# Altium project climCtrl_V1.PrjPcb
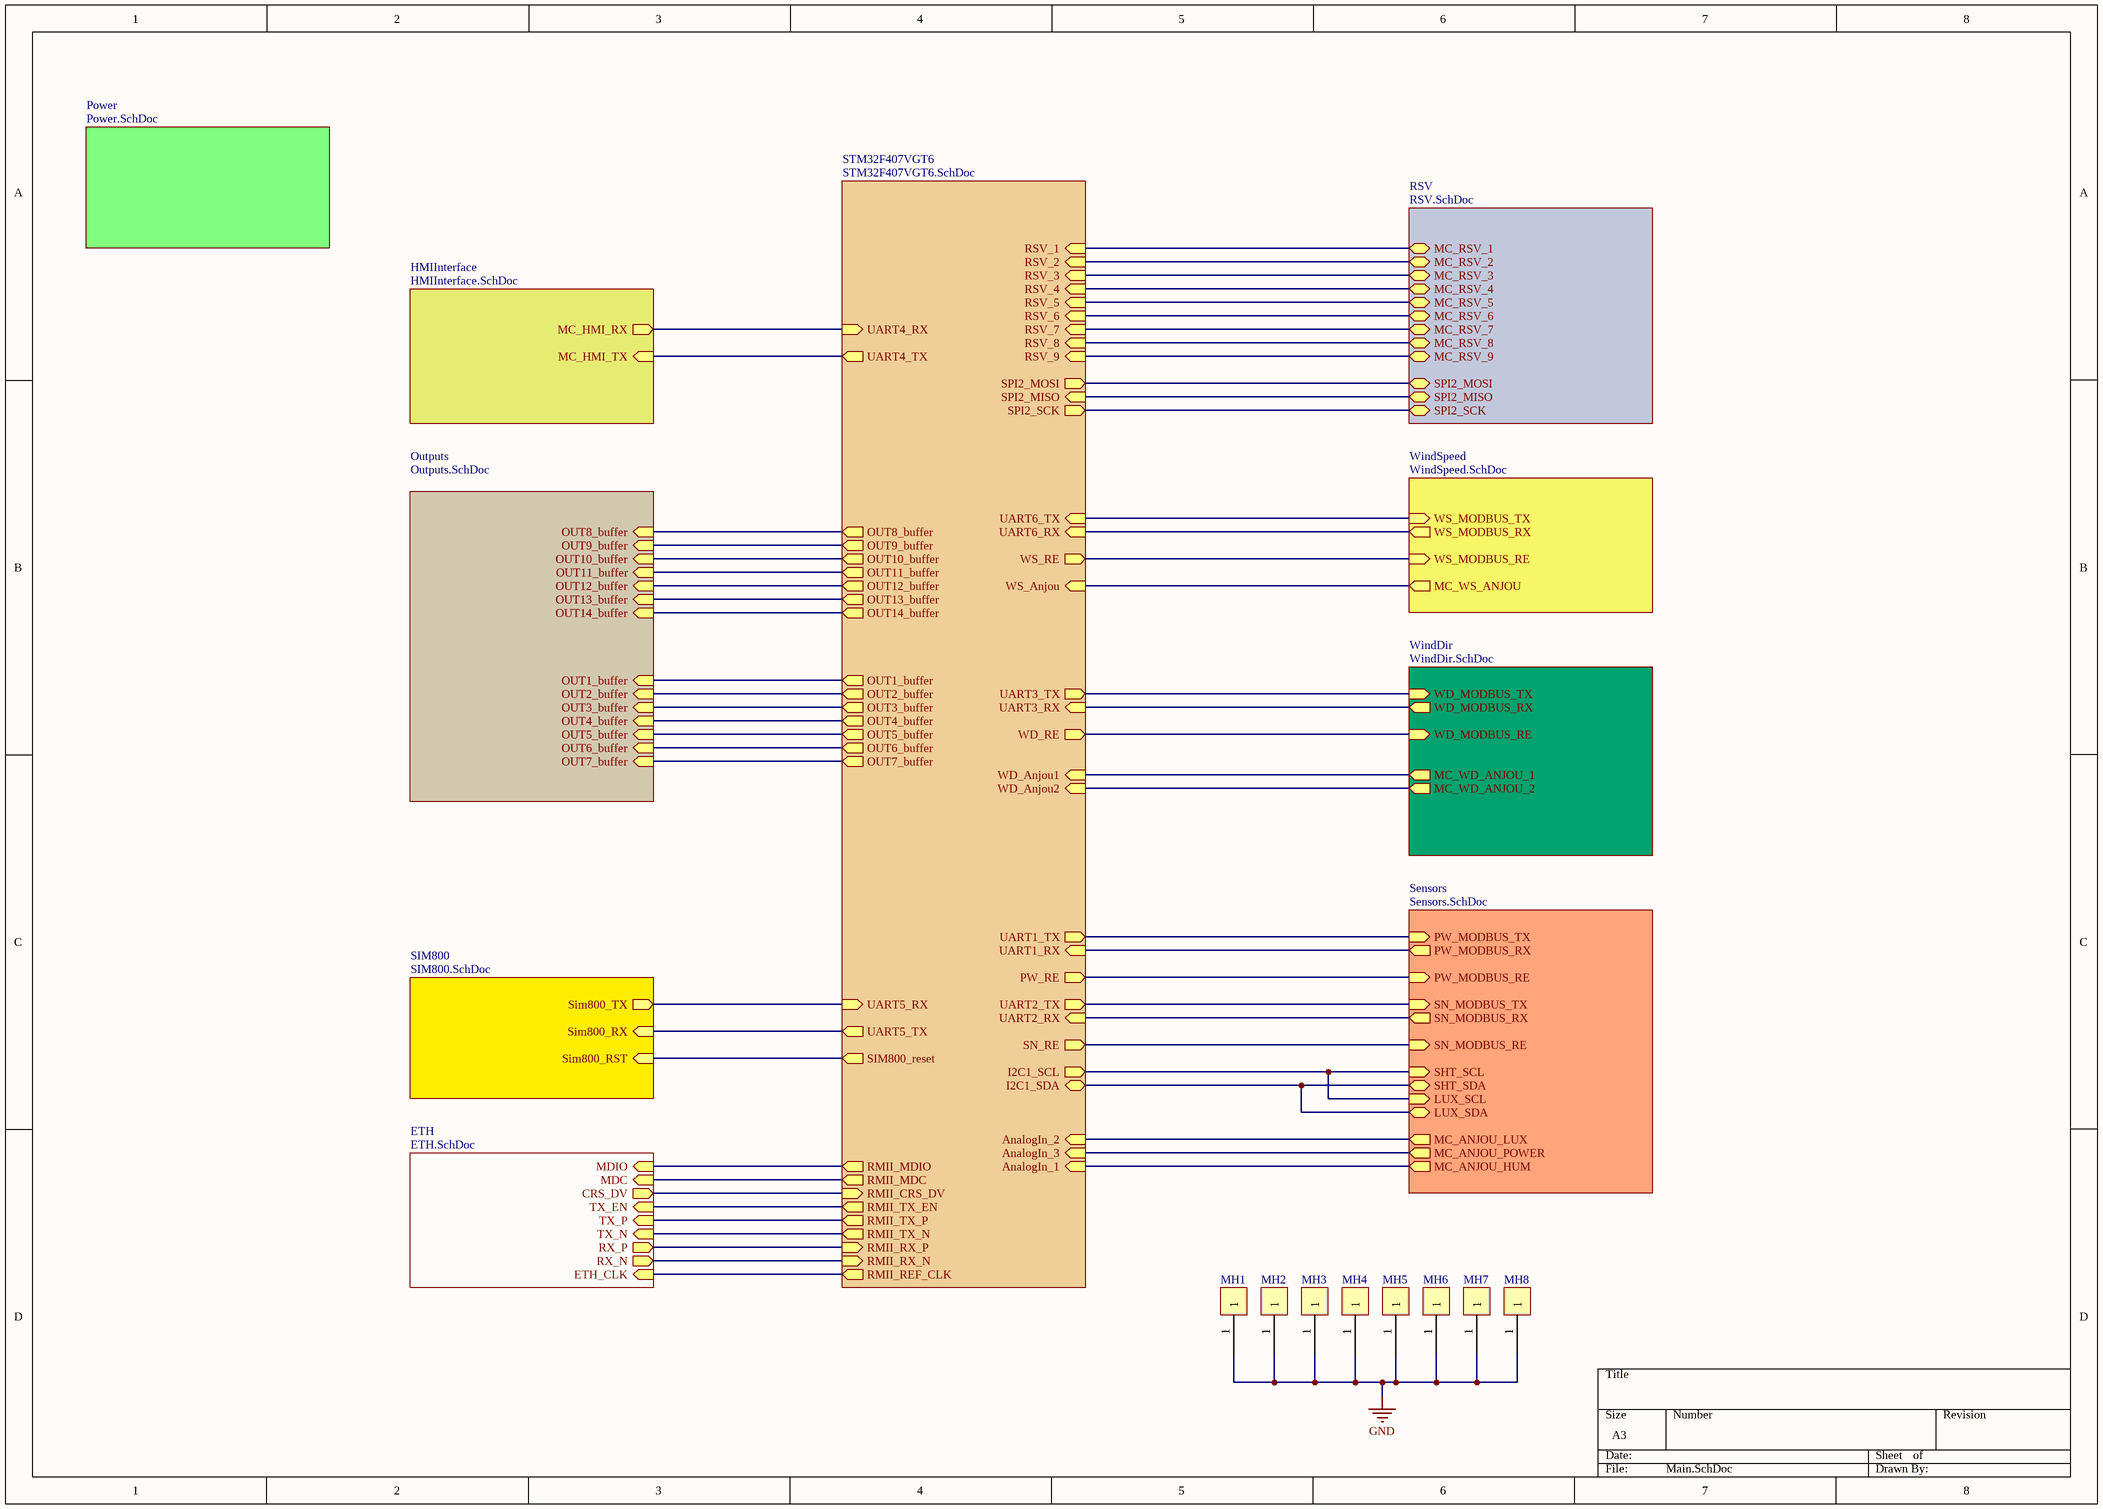
[diagram p0: Main.SchDoc]
11 sheets, 233 parts. Net scope: hierarchical (ports join the sheet entries above them; power ports are global).
Board file: climCtrl_V1.PcbDoc
Sheets:
  Main.SchDoc
    Power = Power.SchDoc
    SIM800 = SIM800.SchDoc
    Outputs = Outputs.SchDoc
    HMIInterface = HMIInterface.SchDoc
    ETH = ETH.SchDoc
    RSV = RSV.SchDoc
    WindSpeed = WindSpeed.SchDoc
    WindDir = WindDir.SchDoc
    Sensors = Sensors.SchDoc
    STM32F407VGT6 = STM32F407VGT6.SchDoc

## Sheet Main.SchDoc
size A3

### Parts
MH1  HOLE_3mm  [Hole_3mm]  (value not drawn)
MH2  HOLE_3mm  [Hole_3mm]  (value not drawn)
MH3  HOLE_3mm  [Hole_3mm]  (value not drawn)
MH4  HOLE_3mm  [Hole_3mm]  (value not drawn)
MH5  HOLE_3mm  [Hole_3mm]  (value not drawn)
MH6  HOLE_3mm  [Hole_3mm]  (value not drawn)
MH7  HOLE_3mm  [Hole_3mm]  (value not drawn)
MH8  HOLE_3mm  [Hole_3mm]  (value not drawn)

### Sub-sheets
ETH = ETH.SchDoc: ETH_CLK (in), TX_P (in), TX_N (in), CRS_DV (out), RX_N (out), RX_P (out), TX_EN (in), MDC (in), MDIO (in)
HMIInterface = HMIInterface.SchDoc: MC_HMI_RX (out), MC_HMI_TX (in)
Outputs = Outputs.SchDoc: OUT13_buffer (in), OUT6_buffer (in), OUT14_buffer (in), OUT8_buffer (in), OUT7_buffer (in), OUT10_buffer (in), OUT11_buffer (in), OUT4_buffer (in), OUT3_buffer (in), OUT12_buffer (in), OUT9_buffer (in), OUT5_buffer (in), OUT2_buffer (in), OUT1_buffer (in)
Power = Power.SchDoc: no entries
RSV = RSV.SchDoc: MC_RSV_9, MC_RSV_6, MC_RSV_3, MC_RSV_8, MC_RSV_5, MC_RSV_2, MC_RSV_7, MC_RSV_1, MC_RSV_4, SPI2_MOSI, SPI2_MISO, SPI2_SCK
Sensors = Sensors.SchDoc: SN_MODBUS_TX (in), SN_MODBUS_RX (out), SHT_SCL (in), SHT_SDA (bidir), SN_MODBUS_RE (in), LUX_SDA (bidir), LUX_SCL (in), PW_MODBUS_TX (in), MC_ANJOU_HUM (out), PW_MODBUS_RX (out), PW_MODBUS_RE (in), MC_ANJOU_LUX (out), MC_ANJOU_POWER (out)
SIM800 = SIM800.SchDoc: Sim800_RX (in), Sim800_TX (out), Sim800_RST (in)
STM32F407VGT6 = STM32F407VGT6.SchDoc: RMII_MDIO (out), RMII_TX_EN (out), RMII_TX_N (out), RMII_CRS_DV (in), RMII_MDC (out), RMII_RX_P (in), RMII_RX_N (in), RMII_TX_P (out), RMII_REF_CLK (out), UART6_RX (in), UART6_TX (in), UART1_TX (out), UART1_RX (in), UART3_RX (in), UART3_TX (out), UART2_TX (out), UART2_RX (in), UART5_RX (in), UART4_TX (out), UART4_RX (in), UART5_TX (out), WD_RE (out), WD_Anjou1 (in), WD_Anjou2 (in), WS_RE (out), WS_Anjou (in), SN_RE (out), OUT8_buffer (out), OUT9_buffer (out), OUT10_buffer (out), OUT11_buffer (out), OUT12_buffer (out), OUT13_buffer (out), OUT14_buffer (out), OUT5_buffer (out), OUT6_buffer (out), OUT7_buffer (out), OUT1_buffer (out), OUT2_buffer (out), OUT3_buffer (out), OUT4_buffer (out), AnalogIn_2 (in), AnalogIn_3 (in), AnalogIn_1 (in), RSV_2 (in), RSV_1 (in), RSV_3 (in), RSV_4 (in), RSV_5 (in), RSV_6 (in), RSV_7 (in), RSV_8 (in), RSV_9 (in), SIM800_reset (out), SPI2_MOSI (out), SPI2_MISO (in), SPI2_SCK (out), I2C1_SCL (out), I2C1_SDA (bidir), PW_RE (out)
WindDir = WindDir.SchDoc: MC_WD_ANJOU_2 (out), WD_MODBUS_RE (in), WD_MODBUS_RX (out), WD_MODBUS_TX (in), MC_WD_ANJOU_1 (out)
WindSpeed = WindSpeed.SchDoc: WS_MODBUS_TX (in), WS_MODBUS_RE (in), MC_WS_ANJOU (out), WS_MODBUS_RX (out)

### Nets
GND: MH1.1 MH2.1 MH3.1 MH4.1 MH5.1 MH6.1 MH7.1 MH8.1
AnalogIn_1: sheet Sensors/MC_ANJOU_HUM, sheet STM32F407VGT6/AnalogIn_1
AnalogIn_2: sheet Sensors/MC_ANJOU_LUX, sheet STM32F407VGT6/AnalogIn_2
AnalogIn_3: sheet Sensors/MC_ANJOU_POWER, sheet STM32F407VGT6/AnalogIn_3
CLK_50MHz: sheet ETH/ETH_CLK, sheet STM32F407VGT6/RMII_REF_CLK
LUX_SCL: sheet Sensors/SHT_SCL, sheet Sensors/LUX_SCL, sheet STM32F407VGT6/I2C1_SCL
LUX_SDA: sheet Sensors/SHT_SDA, sheet Sensors/LUX_SDA, sheet STM32F407VGT6/I2C1_SDA
MC_HMI_RX: sheet HMIInterface/MC_HMI_RX, sheet STM32F407VGT6/UART4_RX
MC_HMI_TX: sheet HMIInterface/MC_HMI_TX, sheet STM32F407VGT6/UART4_TX
MC_RSV_1: sheet RSV/MC_RSV_1, sheet STM32F407VGT6/RSV_1
MC_RSV_2: sheet RSV/MC_RSV_2, sheet STM32F407VGT6/RSV_2
MC_RSV_3: sheet RSV/MC_RSV_3, sheet STM32F407VGT6/RSV_3
MC_RSV_4: sheet RSV/MC_RSV_4, sheet STM32F407VGT6/RSV_4
MC_RSV_5: sheet RSV/MC_RSV_5, sheet STM32F407VGT6/RSV_5
MC_RSV_6: sheet RSV/MC_RSV_6, sheet STM32F407VGT6/RSV_6
MC_RSV_7: sheet RSV/MC_RSV_7, sheet STM32F407VGT6/RSV_7
MC_RSV_8: sheet RSV/MC_RSV_8, sheet STM32F407VGT6/RSV_8
MC_RSV_9: sheet RSV/MC_RSV_9, sheet STM32F407VGT6/RSV_9
MC_WD_ANJOU_1: sheet WindDir/MC_WD_ANJOU_1, sheet STM32F407VGT6/WD_Anjou1
MC_WD_ANJOU_2: sheet WindDir/MC_WD_ANJOU_2, sheet STM32F407VGT6/WD_Anjou2
MC_WS_ANJOU: sheet WindSpeed/MC_WS_ANJOU, sheet STM32F407VGT6/WS_Anjou
OUT1_buffer: sheet Outputs/OUT1_buffer, sheet STM32F407VGT6/OUT1_buffer
OUT2_buffer: sheet Outputs/OUT2_buffer, sheet STM32F407VGT6/OUT2_buffer
OUT3_buffer: sheet Outputs/OUT3_buffer, sheet STM32F407VGT6/OUT3_buffer
OUT4_buffer: sheet Outputs/OUT4_buffer, sheet STM32F407VGT6/OUT4_buffer
OUT5_buffer: sheet Outputs/OUT5_buffer, sheet STM32F407VGT6/OUT5_buffer
OUT6_buffer: sheet Outputs/OUT6_buffer, sheet STM32F407VGT6/OUT6_buffer
OUT7_buffer: sheet Outputs/OUT7_buffer, sheet STM32F407VGT6/OUT7_buffer
OUT8_buffer: sheet Outputs/OUT8_buffer, sheet STM32F407VGT6/OUT8_buffer
OUT9_buffer: sheet Outputs/OUT9_buffer, sheet STM32F407VGT6/OUT9_buffer
OUT10_buffer: sheet Outputs/OUT10_buffer, sheet STM32F407VGT6/OUT10_buffer
OUT11_buffer: sheet Outputs/OUT11_buffer, sheet STM32F407VGT6/OUT11_buffer
OUT12_buffer: sheet Outputs/OUT12_buffer, sheet STM32F407VGT6/OUT12_buffer
OUT13_buffer: sheet Outputs/OUT13_buffer, sheet STM32F407VGT6/OUT13_buffer
OUT14_buffer: sheet Outputs/OUT14_buffer, sheet STM32F407VGT6/OUT14_buffer
PW_MODBUS_RE: sheet Sensors/PW_MODBUS_RE, sheet STM32F407VGT6/PW_RE
PW_MODBUS_RX: sheet Sensors/PW_MODBUS_RX, sheet STM32F407VGT6/UART1_RX
PW_MODBUS_TX: sheet Sensors/PW_MODBUS_TX, sheet STM32F407VGT6/UART1_TX
RMII_CRS_DV: sheet ETH/CRS_DV, sheet STM32F407VGT6/RMII_CRS_DV
RMII_MDC: sheet ETH/MDC, sheet STM32F407VGT6/RMII_MDC
RMII_MDIO: sheet ETH/MDIO, sheet STM32F407VGT6/RMII_MDIO
RMII_RX_N: sheet ETH/RX_N, sheet STM32F407VGT6/RMII_RX_N
RMII_RX_P: sheet ETH/RX_P, sheet STM32F407VGT6/RMII_RX_P
RMII_TX_EN: sheet ETH/TX_EN, sheet STM32F407VGT6/RMII_TX_EN
RMII_TX_N: sheet ETH/TX_N, sheet STM32F407VGT6/RMII_TX_N
RMII_TX_P: sheet ETH/TX_P, sheet STM32F407VGT6/RMII_TX_P
Sim800_RX: sheet SIM800/Sim800_RX, sheet STM32F407VGT6/UART5_TX
Sim800_TX: sheet SIM800/Sim800_TX, sheet STM32F407VGT6/UART5_RX
SN_MODBUS_RE: sheet Sensors/SN_MODBUS_RE, sheet STM32F407VGT6/SN_RE
SN_MODBUS_RX: sheet Sensors/SN_MODBUS_RX, sheet STM32F407VGT6/UART2_RX
SN_MODBUS_TX: sheet Sensors/SN_MODBUS_TX, sheet STM32F407VGT6/UART2_TX
SPI2_MISO: sheet RSV/SPI2_MISO, sheet STM32F407VGT6/SPI2_MISO
SPI2_MOSI: sheet RSV/SPI2_MOSI, sheet STM32F407VGT6/SPI2_MOSI
SPI2_SCK: sheet RSV/SPI2_SCK, sheet STM32F407VGT6/SPI2_SCK
UART3_RX: sheet WindDir/WD_MODBUS_RX, sheet STM32F407VGT6/UART3_RX
UART3_TX: sheet WindDir/WD_MODBUS_TX, sheet STM32F407VGT6/UART3_TX
UART6_RX: sheet WindSpeed/WS_MODBUS_RX, sheet STM32F407VGT6/UART6_RX
UART6_TX: sheet WindSpeed/WS_MODBUS_TX, sheet STM32F407VGT6/UART6_TX
WD_MODBUS_RE: sheet WindDir/WD_MODBUS_RE, sheet STM32F407VGT6/WD_RE
WS_MODBUS_RE: sheet WindSpeed/WS_MODBUS_RE, sheet STM32F407VGT6/WS_RE
NetM1_4: sheet SIM800/Sim800_RST, sheet STM32F407VGT6/SIM800_reset

## Sheet Power.SchDoc
size A3
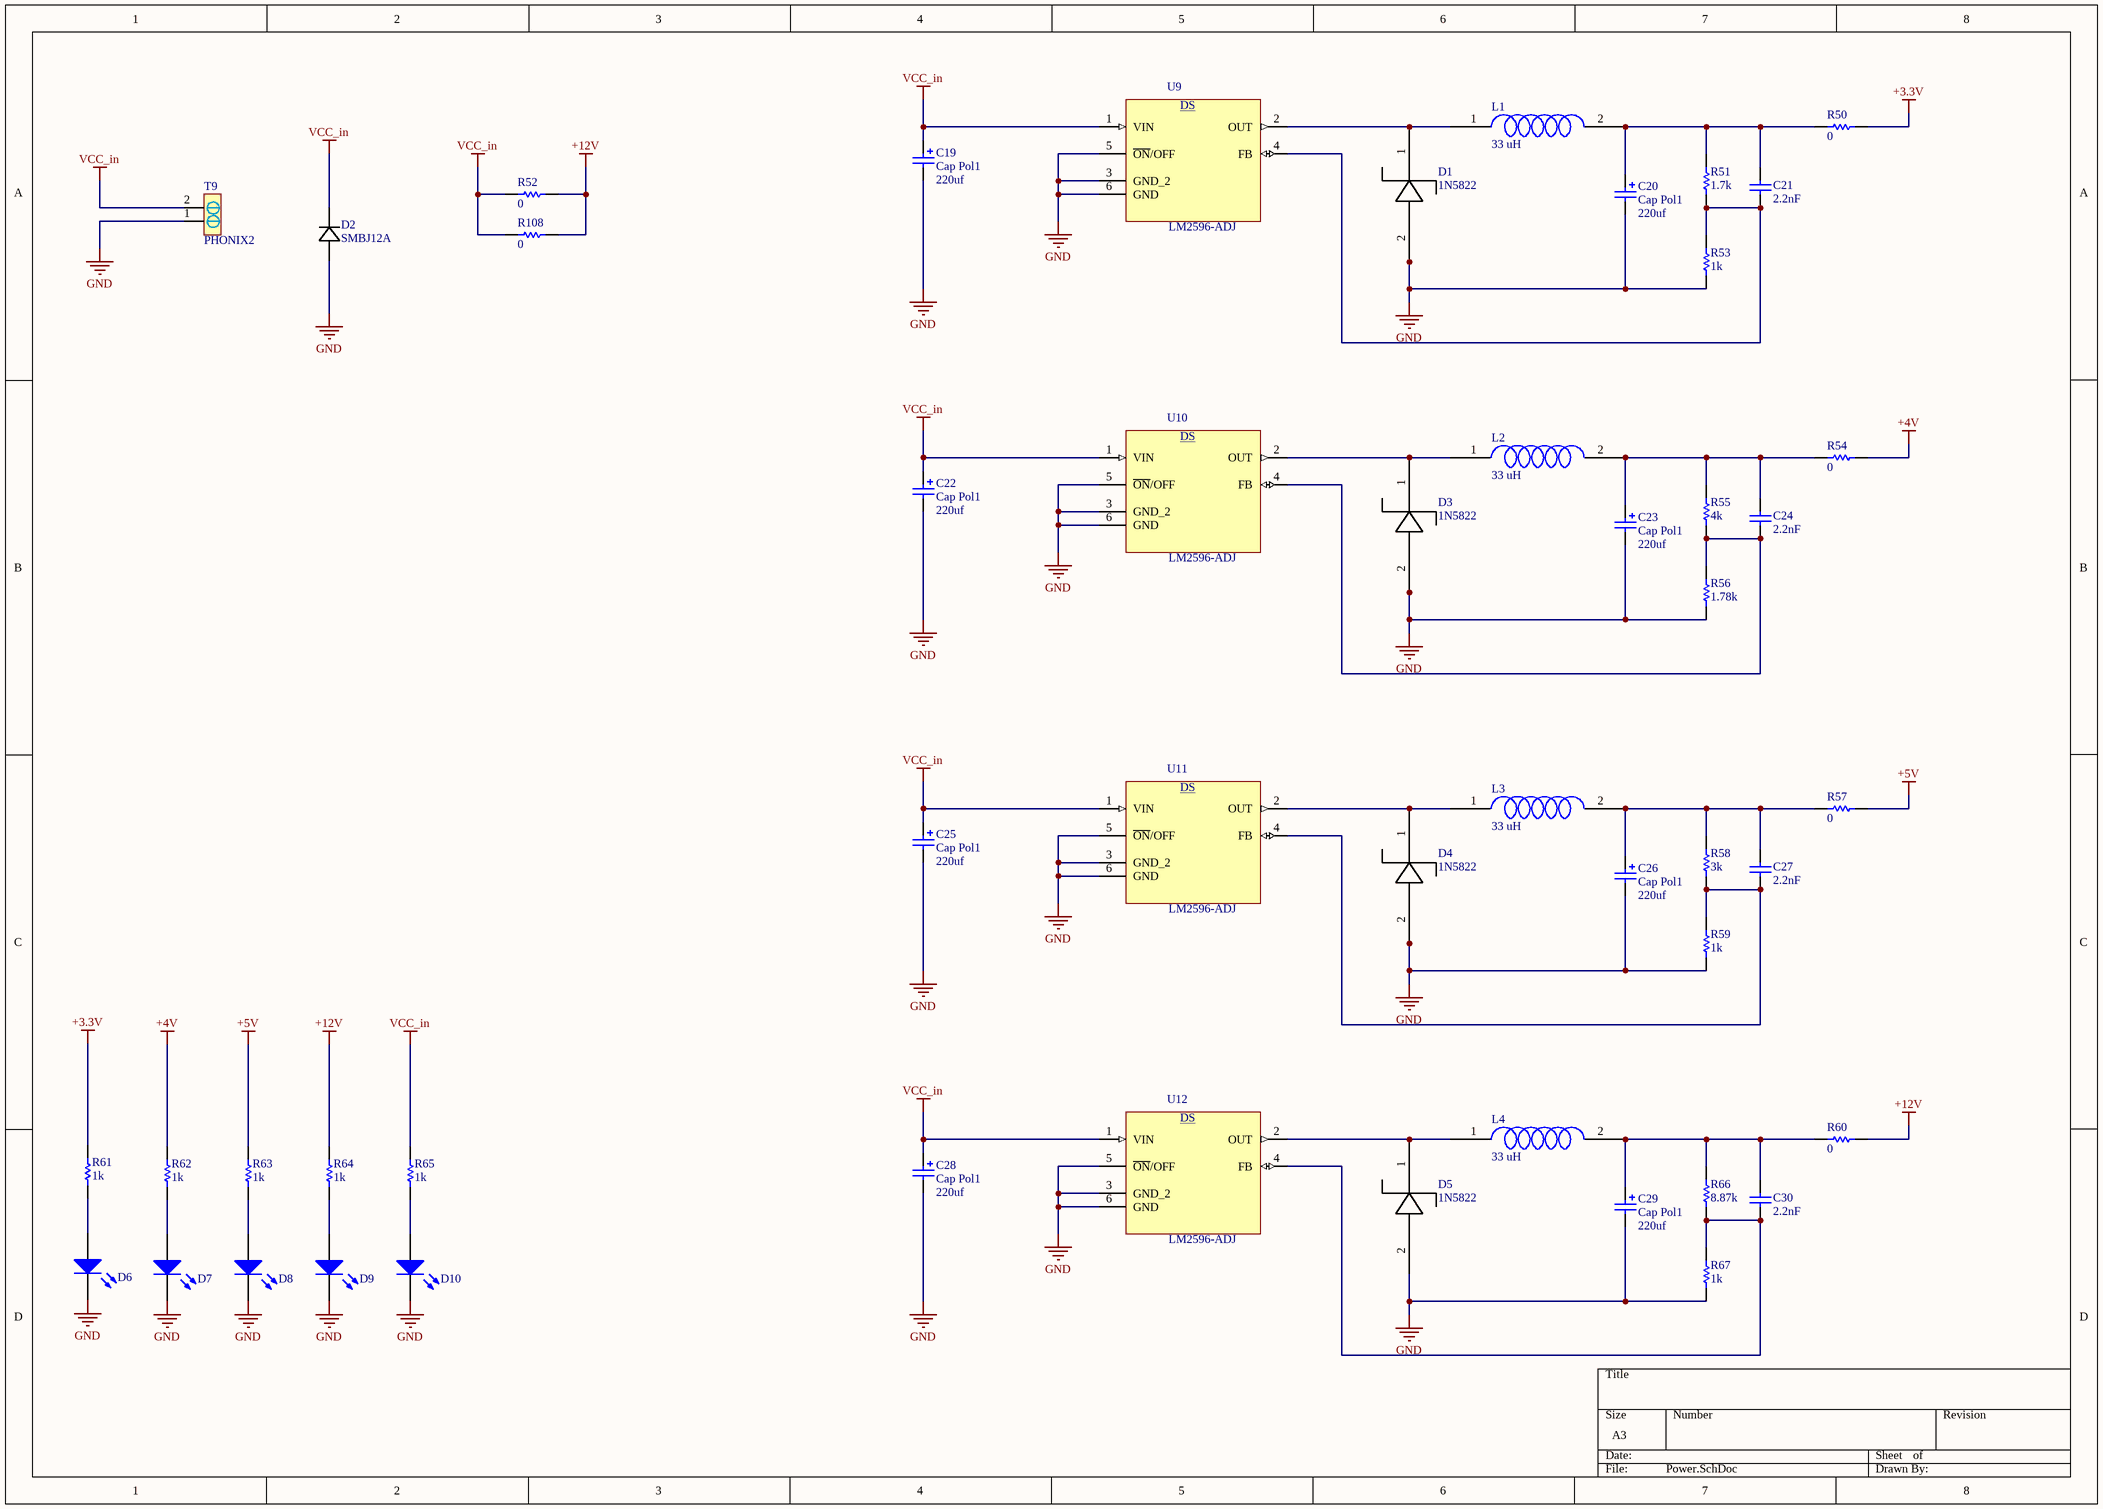
[diagram p1: Power.SchDoc]

### Parts
C19  Cap Pol1  value 220uf  [RB5-10.5]
C20  Cap Pol1  value 220uf  [RB5-10.5]
C21  value 2.2nF  [C-805]  (hidden comment: C-805)
C22  Cap Pol1  value 220uf  [RB5-10.5]
C23  Cap Pol1  value 220uf  [RB5-10.5]
C24  value 2.2nF  [C-805]  (hidden comment: C-805)
C25  Cap Pol1  value 220uf  [RB5-10.5]
C26  Cap Pol1  value 220uf  [RB5-10.5]
C27  value 2.2nF  [C-805]  (hidden comment: C-805)
C28  Cap Pol1  value 220uf  [RB5-10.5]
C29  Cap Pol1  value 220uf  [RB5-10.5]
C30  value 2.2nF  [C-805]  (hidden comment: C-805)
D1  1N5822  [1N5822]
D2  SMBJ12A  [SMB]
D3  1N5822  [1N5822]
D4  1N5822  [1N5822]
D5  1N5822  [1N5822]
D6  LED  [LED-805]  (value not drawn)
D7  LED  [LED-805]  (value not drawn)
D8  LED  [LED-805]  (value not drawn)
D9  LED  [LED-805]  (value not drawn)
D10  LED  [LED-805]  (value not drawn)
L1  33 uH  [Inductor]
L2  33 uH  [Inductor]
L3  33 uH  [Inductor]
L4  33 uH  [Inductor]
R50  value 0  [R-1206]  (hidden comment: R-1206)
R51  value 1.7k  [R-805]  (hidden comment: R-805)
R52  value 0  [R-1206]  (hidden comment: R-1206)
R53  value 1k  [R-805]  (hidden comment: R-805)
R54  value 0  [R-1206]  (hidden comment: R-1206)
R55  value 4k  [R-805]  (hidden comment: R-805)
R56  value 1.78k  [R-805]  (hidden comment: R-805)
R57  value 0  [R-1206]  (hidden comment: R-1206)
R58  value 3k  [R-805]  (hidden comment: R-805)
R59  value 1k  [R-805]  (hidden comment: R-805)
R60  value 0  [R-1206]  (hidden comment: R-1206)
R61  value 1k  [R-805]  (hidden comment: R-805)
R62  value 1k  [R-805]  (hidden comment: R-805)
R63  value 1k  [R-805]  (hidden comment: R-805)
R64  value 1k  [R-805]  (hidden comment: R-805)
R65  value 1k  [R-805]  (hidden comment: R-805)
R66  value 8.87k  [R-805]  (hidden comment: R-805)
R67  value 1k  [R-805]  (hidden comment: R-805)
R108  value 0  [R-1206]  (hidden comment: R-1206)
T9  PHONIX2  [PHONIX2]
U9  LM2596-ADJ  [LM2596SX]
U10  LM2596-ADJ  [LM2596SX]
U11  LM2596-ADJ  [LM2596SX]
U12  LM2596-ADJ  [LM2596SX]

### Nets
+3.3V: R50.2 R61.2
+4V: R54.2 R62.2
+5V: R57.2 R63.2
+12V: R52.2 R60.2 R64.2 R108.2
GND: C19.2 C20.2 C22.2 C23.2 C25.2 C26.2 C28.2 C29.2 D1.2 D2.2 D3.2 D4.2 D5.2 D6.2(K) D7.2(K) D8.2(K) D9.2(K) D10.2(K) R53.2 R56.2 R59.2 R67.2 T9.1 U9.3(GND_2) U9.5(~{ON}/OFF) U9.6(GND) U10.3(GND_2) U10.5(~{ON}/OFF) U10.6(GND) U11.3(GND_2) U11.5(~{ON}/OFF) U11.6(GND) U12.3(GND_2) U12.5(~{ON}/OFF) U12.6(GND)
VCC_in: C19.1 C22.1 C25.1 C28.1 D2.1 R52.1 R65.2 R108.1 T9.2 U9.1(VIN) U10.1(VIN) U11.1(VIN) U12.1(VIN)
NetC20_1: C20.1 C21.2 L1.2 R50.1 R51.1
NetC21_1: C21.1 R51.2 R53.1 U9.4(FB)
NetC23_1: C23.1 C24.2 L2.2 R54.1 R55.1
NetC24_1: C24.1 R55.2 R56.1 U10.4(FB)
NetC26_1: C26.1 C27.2 L3.2 R57.1 R58.1
NetC27_1: C27.1 R58.2 R59.1 U11.4(FB)
NetC29_1: C29.1 C30.2 L4.2 R60.1 R66.1
NetC30_1: C30.1 R66.2 R67.1 U12.4(FB)
NetD1_1: D1.1 L1.1 U9.2(OUT)
NetD3_1: D3.1 L2.1 U10.2(OUT)
NetD4_1: D4.1 L3.1 U11.2(OUT)
NetD5_1: D5.1 L4.1 U12.2(OUT)
NetD6_1: D6.1(A) R61.1
NetD7_1: D7.1(A) R62.1
NetD8_1: D8.1(A) R63.1
NetD9_1: D9.1(A) R64.1
NetD10_1: D10.1(A) R65.1

### Notes on the sheet
- (in symbol LM2596-ADJ) DS

### Library data of the parts
C19 C20 C22 C23 C25 C26 C28 C29 = Cap Pol1: Polarized Capacitor (Radial); Published: 8-Jun-2000; LatestRevisionDate: 17-Jul-2002; LatestRevisionNote: Re-released for DXP Platform.; PackageReference: RB7.6-15; Publisher: Altium Limited; PackageDescription: Polarized Capacitor (Radial); 2 Leads
C21 C24 C27 C30 = C-805: Capacitor; Published: 8-Jun-2000; LatestRevisionDate: 29-May-2009; LatestRevisionNote: IPC-7351 Footprint Added.; PackageReference: C1206; Publisher: Altium Limited; PackageDescription: Chip Capacitor
D2 = SMBJ12A: No Description Available; Manufacturer_Part_Number: SMBJ12A-13-F; Vendor: Diodes Inc; Built_By: EMA_UL_Team; Type: DEV; Copyright: Copyright (C) 2018 Accelerated Designs. All rights reserved; RefDes: RefDes; Value: Value
D6-D10 = LED-805: LED Size 805; Published: 8-Jun-2000; LatestRevisionDate: 17-Jul-2002; LatestRevisionNote: Re-released for DXP Platform.; PackageVersion: Feb-2002; PackageReference: 3.2X1.6X1.1; Publisher: Altium Limited; PackageDescription: SM LED; 2 Flat Leads
L1-L4 = Inductor: Power inductor
R50 R52 R54 R57 R60 R108 = R-1206: Resistor
R51 R53 R55 R56 R58 R59 R61-R67 = R-805: Resistor
U9-U12 = LM2596-ADJ: SIMPLE SWITCHER Power Converter 150 KHz 3A Step-Down Voltage Regulator 5-DDPAK/TO-263; MF: Texas Instruments; MP: LM2596-ADJ; Package: TO-263-6 Texas Instruments; SnapEDA_Link: https://www.snapeda.com/parts/LM2596SX-12/Texas%20Instruments/view-part/?ref=snap; Price: 1.83 USD; Availability: Unavailable; Value: *

## Sheet SIM800.SchDoc
size A
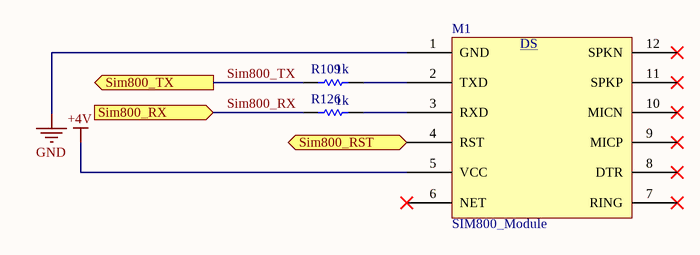
[diagram p2: SIM800.SchDoc]

### Parts
M1  SIM800_Module  [SIM800_Module]
R109  value 1k  [R-805]  (hidden comment: R-805)
R126  value 1k  [R-805]  (hidden comment: R-805)

### Ports
Sim800_RST (in), Sim800_RX (in), Sim800_TX (out)

### Nets
+4V: M1.5(VCC)
GND: M1.1(GND)
Sim800_RX: R126.2 ; port Sim800_RX
Sim800_TX: R109.2 ; port Sim800_TX
NetM1_2: M1.2(TXD) R109.1
NetM1_3: M1.3(RXD) R126.1
NetM1_4: M1.4(RST) ; port Sim800_RST

Not connected (* = marked no-connect by the designer): M1 6(NET)* 7(RING)* 8(DTR)* 9(MICP)* 10(MICN)* 11(SPKP)* 12(SPKN)*

### Notes on the sheet
- (in symbol SIM800_Module) DS

### Library data of the parts
R109 R126 = R-805: Resistor

## Sheet Outputs.SchDoc
size A2
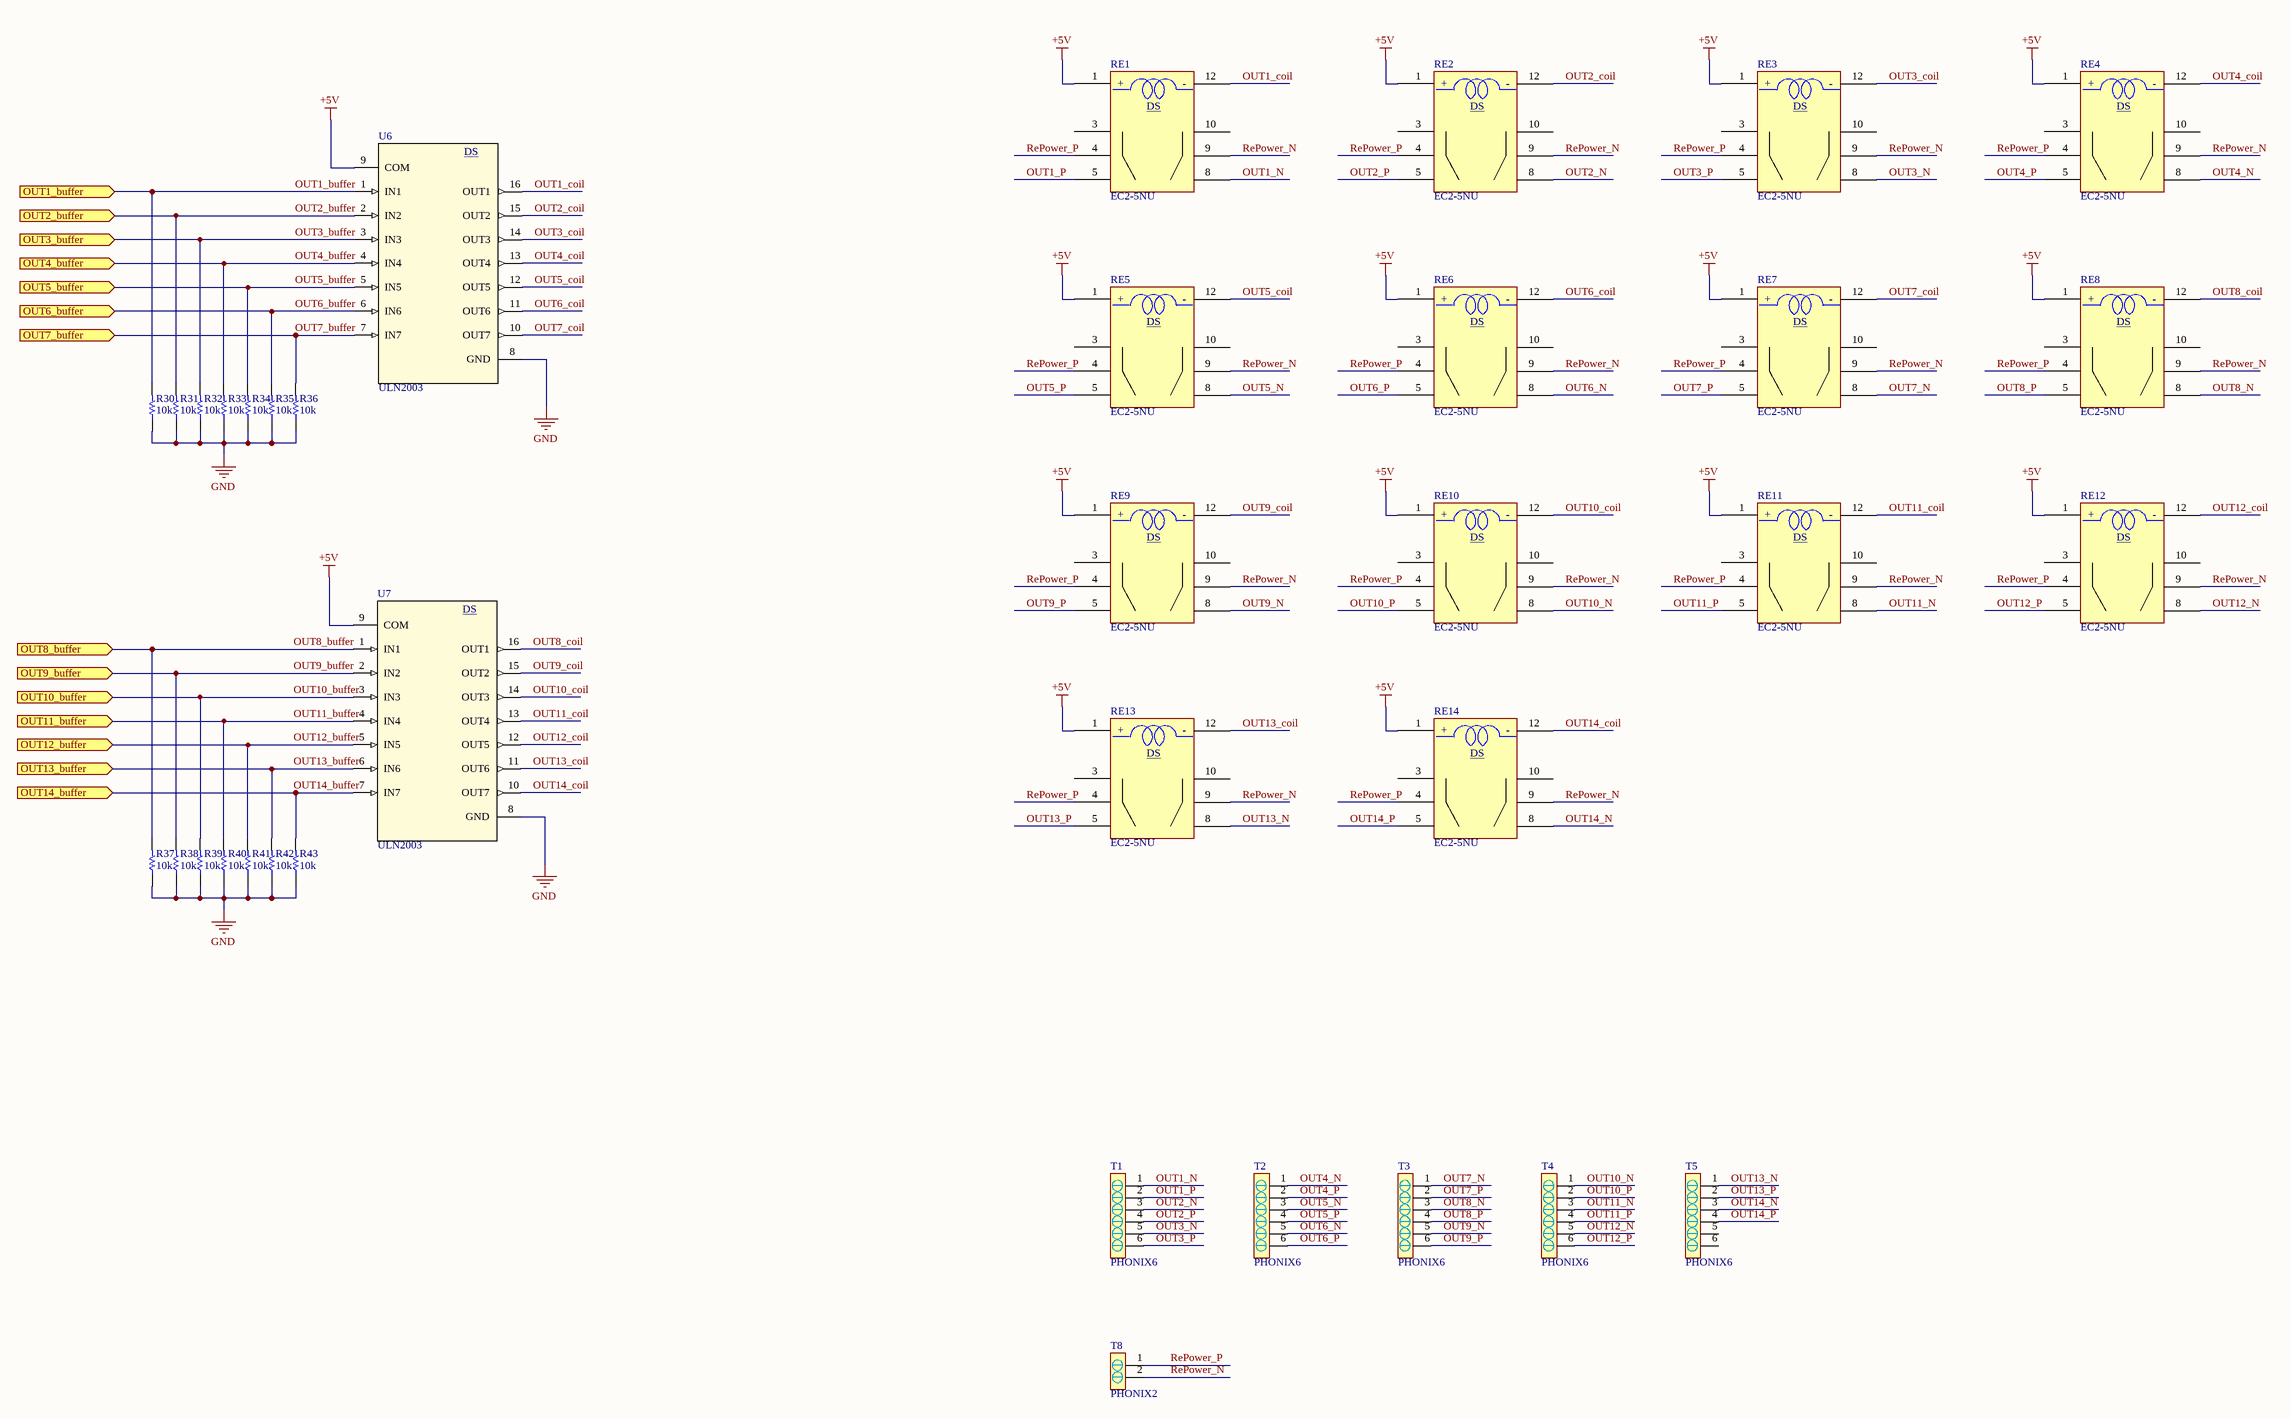
[diagram p3: Outputs.SchDoc]

### Parts
R30  value 10k  [R-805]  (hidden comment: R-805)
R31  value 10k  [R-805]  (hidden comment: R-805)
R32  value 10k  [R-805]  (hidden comment: R-805)
R33  value 10k  [R-805]  (hidden comment: R-805)
R34  value 10k  [R-805]  (hidden comment: R-805)
R35  value 10k  [R-805]  (hidden comment: R-805)
R36  value 10k  [R-805]  (hidden comment: R-805)
R37  value 10k  [R-805]  (hidden comment: R-805)
R38  value 10k  [R-805]  (hidden comment: R-805)
R39  value 10k  [R-805]  (hidden comment: R-805)
R40  value 10k  [R-805]  (hidden comment: R-805)
R41  value 10k  [R-805]  (hidden comment: R-805)
R42  value 10k  [R-805]  (hidden comment: R-805)
R43  value 10k  [R-805]  (hidden comment: R-805)
RE1  EC2-5NU  [EC2-5NU]
RE2  EC2-5NU  [EC2-5NU]
RE3  EC2-5NU  [EC2-5NU]
RE4  EC2-5NU  [EC2-5NU]
RE5  EC2-5NU  [EC2-5NU]
RE6  EC2-5NU  [EC2-5NU]
RE7  EC2-5NU  [EC2-5NU]
RE8  EC2-5NU  [EC2-5NU]
RE9  EC2-5NU  [EC2-5NU]
RE10  EC2-5NU  [EC2-5NU]
RE11  EC2-5NU  [EC2-5NU]
RE12  EC2-5NU  [EC2-5NU]
RE13  EC2-5NU  [EC2-5NU]
RE14  EC2-5NU  [EC2-5NU]
T1  PHONIX6  [PHONIX6]
T2  PHONIX6  [PHONIX6]
T3  PHONIX6  [PHONIX6]
T4  PHONIX6  [PHONIX6]
T5  PHONIX6  [PHONIX6]
T8  PHONIX2  [PHONIX2]
U6  ULN2003  [ULN20003]
U7  ULN2003  [ULN20003]

### Ports
OUT1_buffer (in), OUT2_buffer (in), OUT3_buffer (in), OUT4_buffer (in), OUT5_buffer (in), OUT6_buffer (in), OUT7_buffer (in), OUT8_buffer (in), OUT9_buffer (in), OUT10_buffer (in), OUT11_buffer (in), OUT12_buffer (in), OUT13_buffer (in), OUT14_buffer (in)

### Nets
+5V: RE1.1 RE2.1 RE3.1 RE4.1 RE5.1 RE6.1 RE7.1 RE8.1 RE9.1 RE10.1 RE11.1 RE12.1 RE13.1 RE14.1 U6.9(COM) U7.9(COM)
GND: R30.1 R31.1 R32.1 R33.1 R34.1 R35.1 R36.1 R37.1 R38.1 R39.1 R40.1 R41.1 R42.1 R43.1 U6.8(GND) U7.8(GND)
OUT1_buffer: R30.2 U6.1(IN1) ; port OUT1_buffer
OUT1_coil: RE1.12 U6.16(OUT1)
OUT1_N: RE1.8 T1.1
OUT1_P: RE1.5 T1.2
OUT2_buffer: R31.2 U6.2(IN2) ; port OUT2_buffer
OUT2_coil: RE2.12 U6.15(OUT2)
OUT2_N: RE2.8 T1.3
OUT2_P: RE2.5 T1.4
OUT3_buffer: R32.2 U6.3(IN3) ; port OUT3_buffer
OUT3_coil: RE3.12 U6.14(OUT3)
OUT3_N: RE3.8 T1.5
OUT3_P: RE3.5 T1.6
OUT4_buffer: R33.2 U6.4(IN4) ; port OUT4_buffer
OUT4_coil: RE4.12 U6.13(OUT4)
OUT4_N: RE4.8 T2.1
OUT4_P: RE4.5 T2.2
OUT5_buffer: R34.2 U6.5(IN5) ; port OUT5_buffer
OUT5_coil: RE5.12 U6.12(OUT5)
OUT5_N: RE5.8 T2.3
OUT5_P: RE5.5 T2.4
OUT6_buffer: R35.2 U6.6(IN6) ; port OUT6_buffer
OUT6_coil: RE6.12 U6.11(OUT6)
OUT6_N: RE6.8 T2.5
OUT6_P: RE6.5 T2.6
OUT7_buffer: R36.2 U6.7(IN7) ; port OUT7_buffer
OUT7_coil: RE7.12 U6.10(OUT7)
OUT7_N: RE7.8 T3.1
OUT7_P: RE7.5 T3.2
OUT8_buffer: R37.2 U7.1(IN1) ; port OUT8_buffer
OUT8_coil: RE8.12 U7.16(OUT1)
OUT8_N: RE8.8 T3.3
OUT8_P: RE8.5 T3.4
OUT9_buffer: R38.2 U7.2(IN2) ; port OUT9_buffer
OUT9_coil: RE9.12 U7.15(OUT2)
OUT9_N: RE9.8 T3.5
OUT9_P: RE9.5 T3.6
OUT10_buffer: R39.2 U7.3(IN3) ; port OUT10_buffer
OUT10_coil: RE10.12 U7.14(OUT3)
OUT10_N: RE10.8 T4.1
OUT10_P: RE10.5 T4.2
OUT11_buffer: R40.2 U7.4(IN4) ; port OUT11_buffer
OUT11_coil: RE11.12 U7.13(OUT4)
OUT11_N: RE11.8 T4.3
OUT11_P: RE11.5 T4.4
OUT12_buffer: R41.2 U7.5(IN5) ; port OUT12_buffer
OUT12_coil: RE12.12 U7.12(OUT5)
OUT12_N: RE12.8 T4.5
OUT12_P: RE12.5 T4.6
OUT13_buffer: R42.2 U7.6(IN6) ; port OUT13_buffer
OUT13_coil: RE13.12 U7.11(OUT6)
OUT13_N: RE13.8 T5.1
OUT13_P: RE13.5 T5.2
OUT14_buffer: R43.2 U7.7(IN7) ; port OUT14_buffer
OUT14_coil: RE14.12 U7.10(OUT7)
OUT14_N: RE14.8 T5.3
OUT14_P: RE14.5 T5.4
RePower_N: RE1.9 RE2.9 RE3.9 RE4.9 RE5.9 RE6.9 RE7.9 RE8.9 RE9.9 RE10.9 RE11.9 RE12.9 RE13.9 RE14.9 T8.2
RePower_P: RE1.4 RE2.4 RE3.4 RE4.4 RE5.4 RE6.4 RE7.4 RE8.4 RE9.4 RE10.4 RE11.4 RE12.4 RE13.4 RE14.4 T8.1

Not connected (* = marked no-connect by the designer): RE1 3 10; RE2 3 10; RE3 3 10; RE4 3 10; RE5 3 10; RE6 3 10; RE7 3 10; RE8 3 10; RE9 3 10; RE10 3 10; RE11 3 10; RE12 3 10; RE13 3 10; RE14 3 10; T5 5 6

### Notes on the sheet
- (in symbol EC2_5NU) +; -; DS
- (in symbol ULN2003) DS

### Library data of the parts
R30-R43 = R-805: Resistor
RE1-RE14 = EC2_5NU
U6 U7 = ULN2003: No Description Available; PartNumber: ULN2003ADR; Manufacturer: Texas Instruments; RefDes: RefDes; Type: DEV; Value: Value; Copyright: Copyright (C) 2018 Accelerated Designs. All rights reserved

## Sheet HMIInterface.SchDoc
size A3
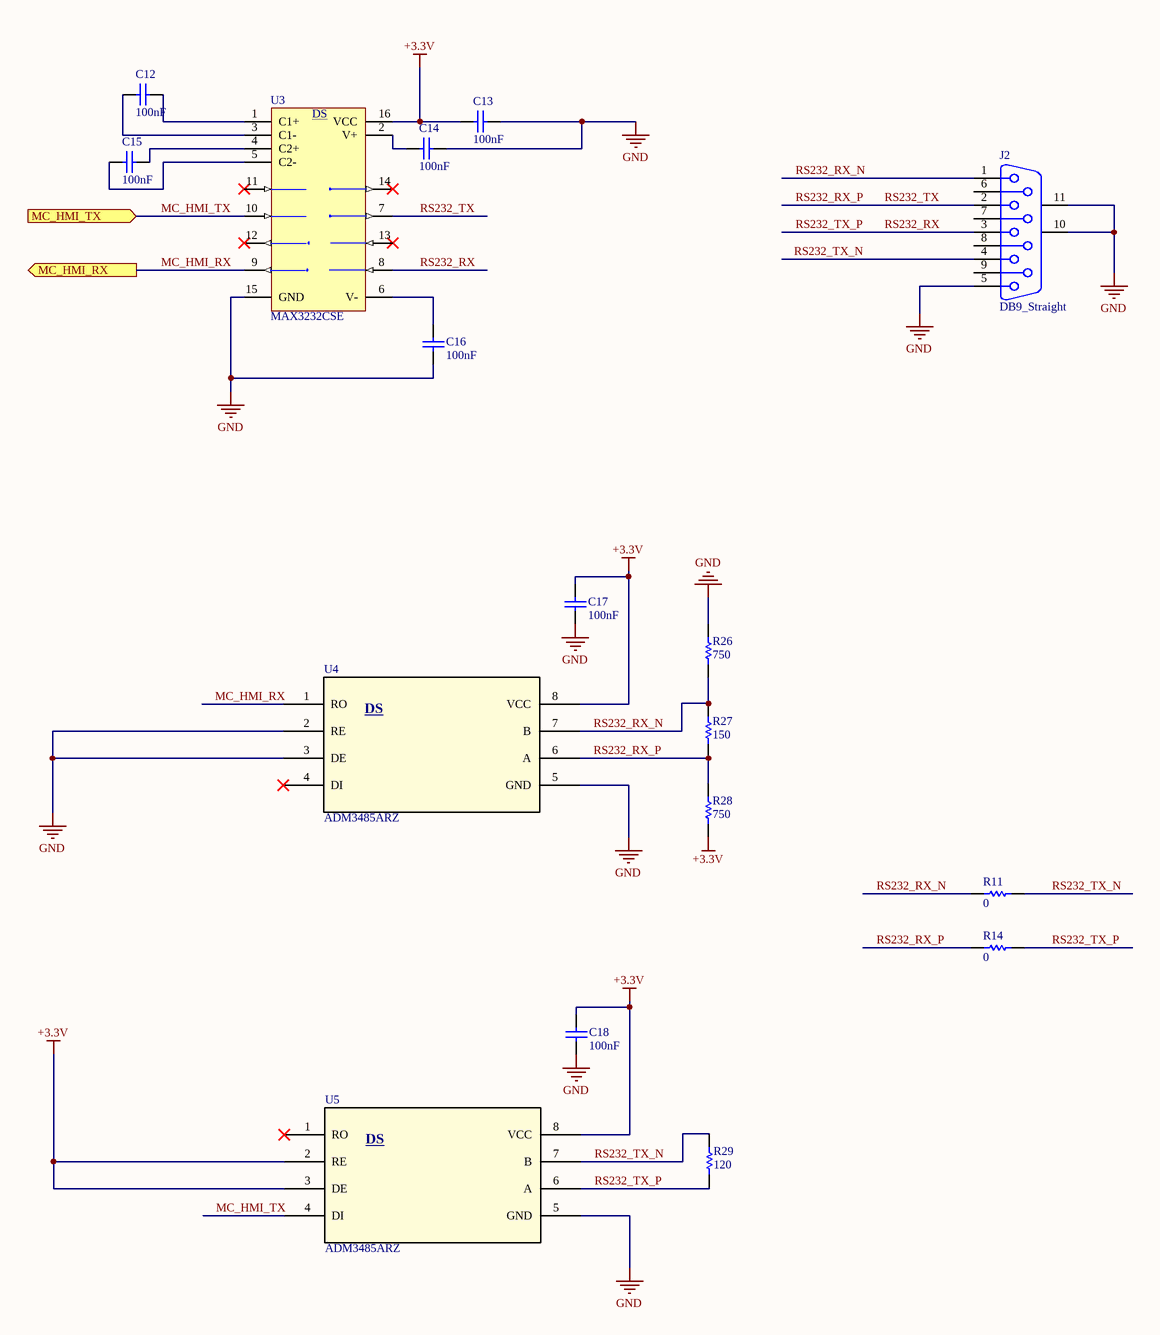
[diagram p4: HMIInterface.SchDoc]

### Parts
C12  value 100nF  [C-805]  (hidden comment: C-805)
C13  value 100nF  [C-805]  (hidden comment: C-805)
C14  value 100nF  [C-805]  (hidden comment: C-805)
C15  value 100nF  [C-805]  (hidden comment: C-805)
C16  value 100nF  [C-805]  (hidden comment: C-805)
C17  value 100nF  [C-805]  (hidden comment: C-805)
C18  value 100nF  [C-805]  (hidden comment: C-805)
J2  DB9_Straight  [DB9_Straight]
R11  value 0  [R-805]  (hidden comment: R-805)
R14  value 0  [R-805]  (hidden comment: R-805)
R26  value 750  [R-805]  (hidden comment: R-805)
R27  value 150  [R-805]  (hidden comment: R-805)
R28  value 750  [R-805]  (hidden comment: R-805)
R29  value 120  [R-805]  (hidden comment: R-805)
U3  MAX3232CSE  [MAX3232CSE]
U4  ADM3485ARZ  [R_8]
U5  ADM3485ARZ  [R_8]

### Ports
MC_HMI_RX (out), MC_HMI_TX (in)

### Nets
+3.3V: C13.2 C17.2 C18.2 R28.1 U3.16(VCC) U4.8(VCC) U5.2(RE) U5.3(DE) U5.8(VCC)
GND: C13.1 C14.1 C16.1 C17.1 C18.1 J2.5 J2.10(MH1) J2.11(MH2) R26.2 U3.15(GND) U4.2(RE) U4.3(DE) U4.5(GND) U5.5(GND)
MC_HMI_RX: U3.9(R2OUT) U4.1(RO) ; port MC_HMI_RX
MC_HMI_TX: U3.10(T2IN) U5.4(DI) ; port MC_HMI_TX
RS232_RX: J2.3 R14.1 R29.1 U3.8(R2IN) U5.6(A)  [also labelled RS232_TX_P]
RS232_RX_N: J2.1 R11.2 R26.1 R27.2 U4.7(B)
RS232_RX_P: J2.2 R14.2 R27.1 R28.2 U3.7(T2OUT) U4.6(A)  [also labelled RS232_TX]
RS232_TX_N: J2.4 R11.1 R29.2 U5.7(B)
NetC12_1: C12.1 U3.1(C1+)
NetC12_2: C12.2 U3.3(C1-)
NetC14_2: C14.2 U3.2(V+)
NetC15_1: C15.1 U3.4(C2+)
NetC15_2: C15.2 U3.5(C2-)
NetC16_2: C16.2 U3.6(V-)

Not connected (* = marked no-connect by the designer): J2 6 7 8 9; U3 11(T1IN)* 12(R1OUT)* 13(R1IN)* 14(T1OUT)*; U4 4(DI)*; U5 1(RO)*

### Notes on the sheet
- (in symbol ADM3485ARZ) DS
- (in symbol MAX3232CSE) DS

### Library data of the parts
C12-C18 = C-805: Capacitor; Published: 8-Jun-2000; LatestRevisionDate: 29-May-2009; LatestRevisionNote: IPC-7351 Footprint Added.; PackageReference: C1206; Publisher: Altium Limited; PackageDescription: Chip Capacitor
J2 = DB9_Straight: Receptacle Assembly, 9 Position, Right Angle; PackageDocument: O; Positions: 9; Published: 15-Jun-2001; LatestRevisionDate: 17-Jul-2002; LatestRevisionNote: Re-released for DXP Platform.; DatasheetDocument: 1-Sep-1999; PackageReference: 788750; Publisher: Altium Limited; Orientation: Right Angle; Gender: Receptacle
R11 R14 R26-R29 = R-805: Resistor
U3 = MAX3232CSE: 3.0V TO 5.5V, Low-Power, up to 1Mbps, True RS-232 Transceiver Using Four 0.1µF External Capacitor; Published: 16-Jan-2001; LatestRevisionDate: 13-Apr-2006; LatestRevisionNote: IPC-7351 Footprint Added.; DatasheetVersion: Mar-1999; PackageReference: NSO16; Publisher: Altium Limited; PackageDescription: 16-Pin Small Outline Integrated Circuit 1.27 mm Pitch; Code_JEDEC: MS-012-AC; Code_IPC: SOIC127P600-16; ComponentLink1Description: Manufacturer Link; ComponentLink1URL: http://www.maxim-ic.com/; ComponentLink2Description: Datasheet; ComponentLink2URL: http://pdfserv.maxim-ic.com/en/ds/MAX3222-MAX3241.pdf
U4 U5 = ADM3485ARZ: No Description Available; Vendor: Analog Devices Inc; Built_By: EMA_UL_Team; Manufacturer_Part_Number: ADM3485ARZ; Copyright: Copyright (C) 2018 Accelerated Designs. All rights reserved; RefDes: RefDes; Type: DEV; Value: Value

## Sheet ETH.SchDoc
size A3
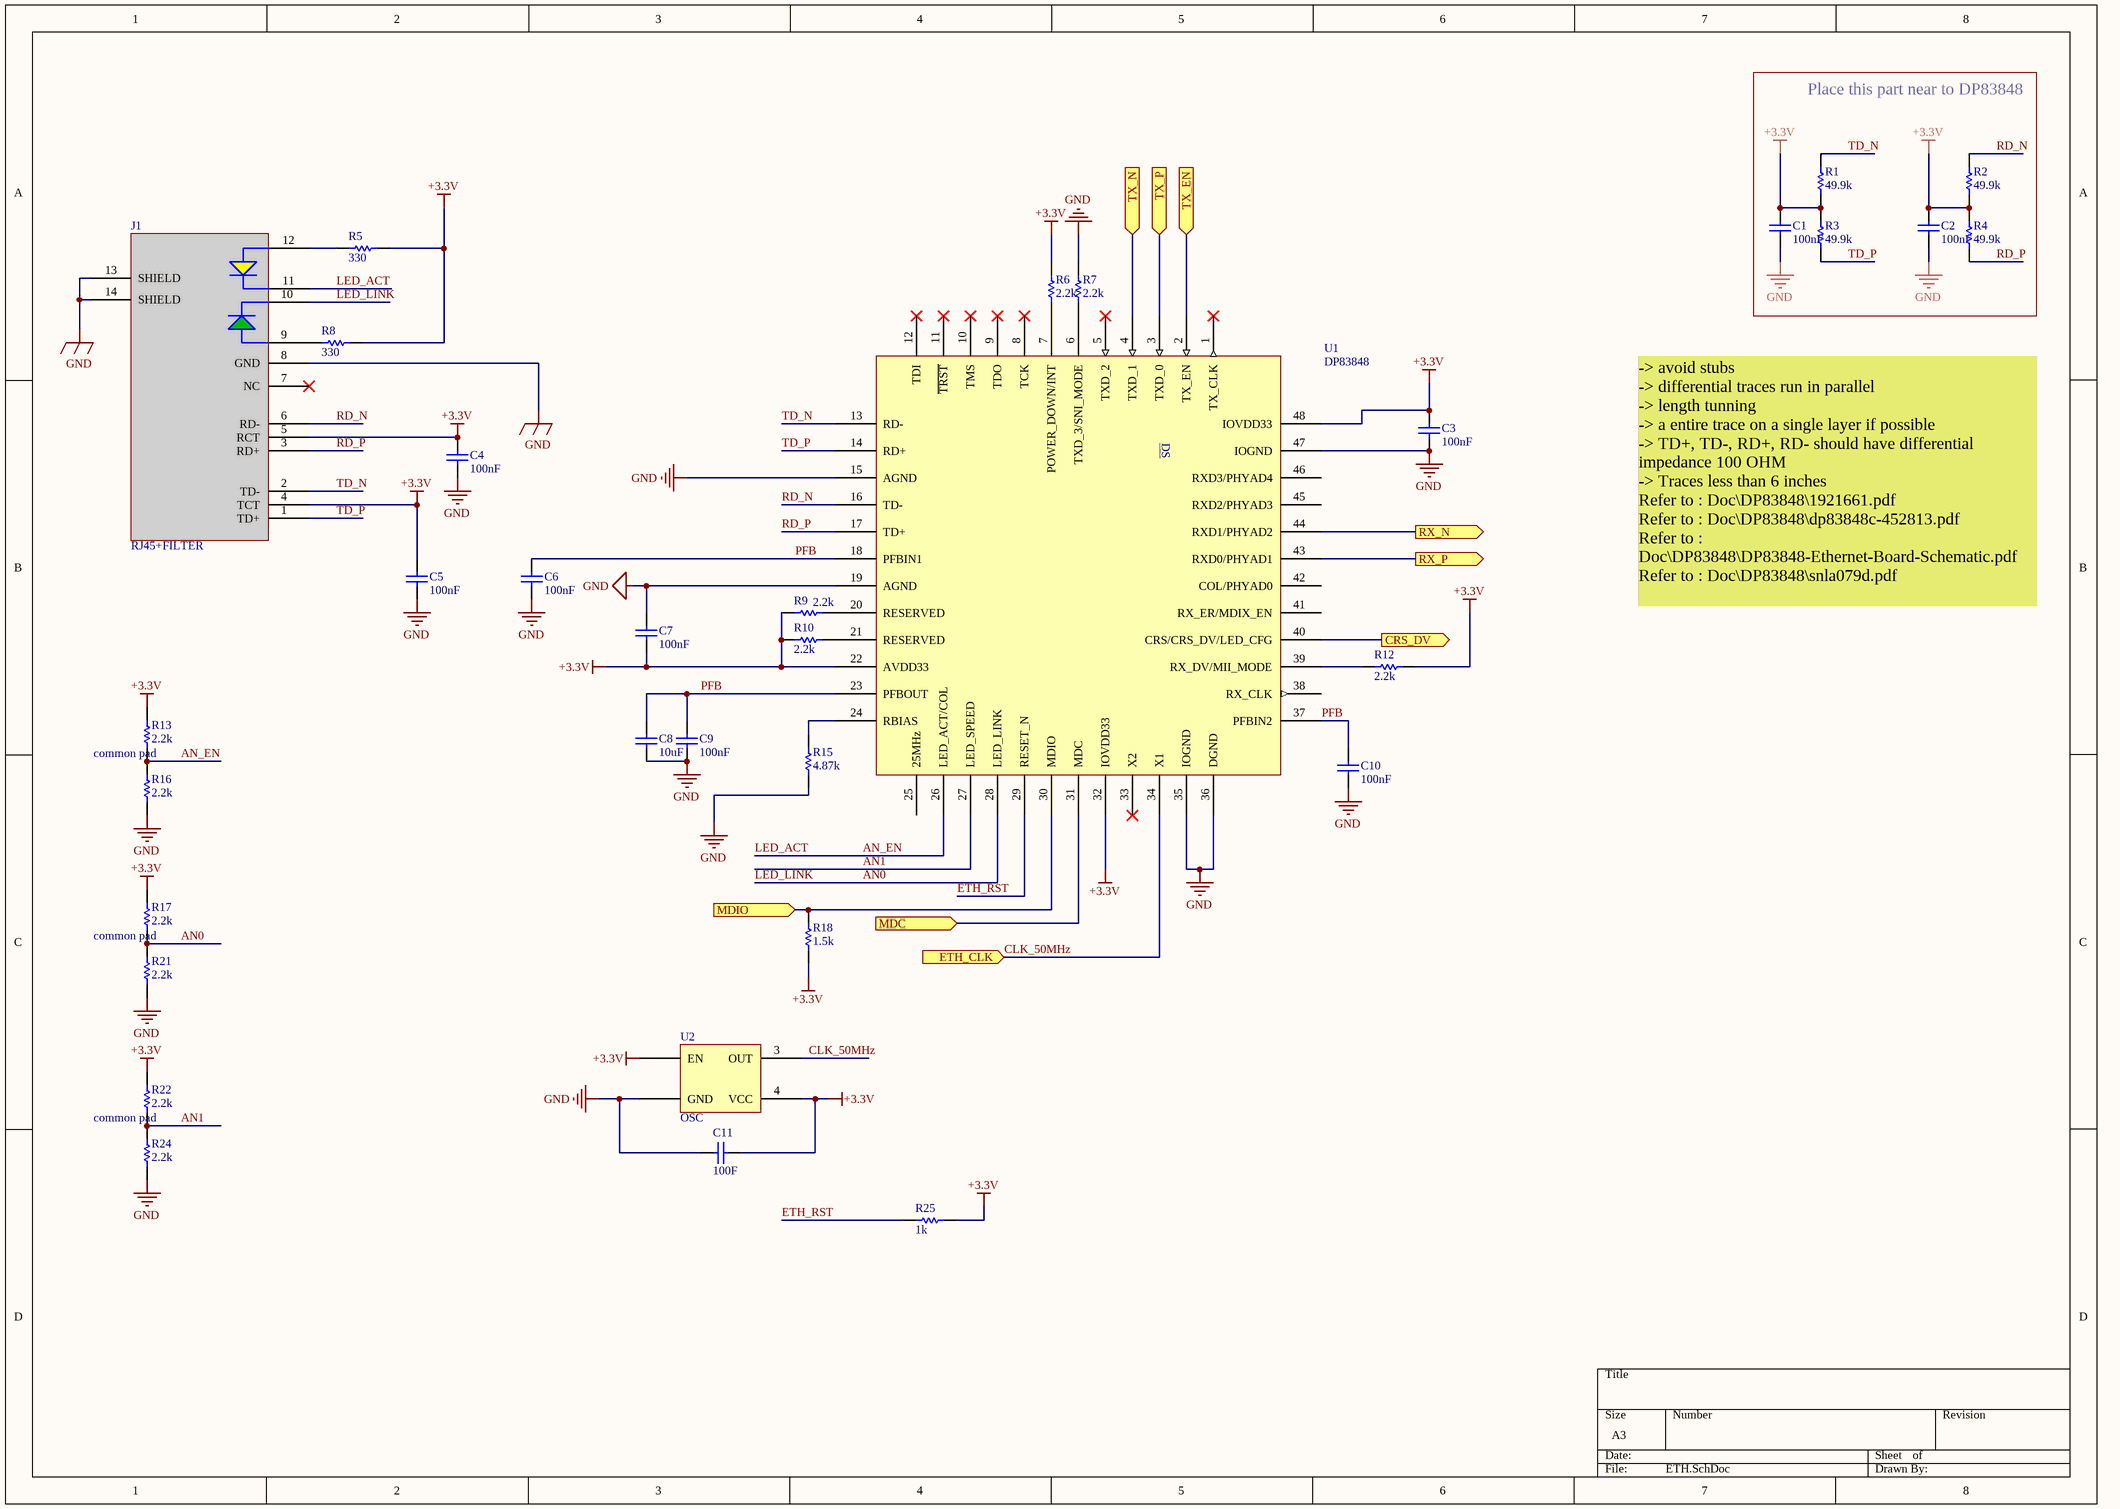
[diagram p5: ETH.SchDoc]

### Parts
C1  value 100nF  [C-805]  (hidden comment: C-805)
C2  value 100nF  [C-805]  (hidden comment: C-805)
C3  value 100nF  [C-805]  (hidden comment: C-805)
C4  value 100nF  [C-805]  (hidden comment: C-805)
C5  value 100nF  [C-805]  (hidden comment: C-805)
C6  value 100nF  [C-805]  (hidden comment: C-805)
C7  value 100nF  [C-805]  (hidden comment: C-805)
C8  value 10uF  [C-805]  (hidden comment: C-805)
C9  value 100nF  [C-805]  (hidden comment: C-805)
C10  value 100nF  [C-805]  (hidden comment: C-805)
C11  value 100F  [C-805]  (hidden comment: C-805)
J1  RJ45+FILTER  [RJ45]
R1  value 49.9k  [R-805]  (hidden comment: R-805)
R2  value 49.9k  [R-805]  (hidden comment: R-805)
R3  value 49.9k  [R-805]  (hidden comment: R-805)
R4  value 49.9k  [R-805]  (hidden comment: R-805)
R5  value 330  [R-805]  (hidden comment: R-805)
R6  value 2.2k  [R-805]  (hidden comment: R-805)
R7  value 2.2k  [R-805]  (hidden comment: R-805)
R8  value 330  [R-805]  (hidden comment: R-805)
R9  value 2.2k  [R-805]  (hidden comment: R-805)
R10  value 2.2k  [R-805]  (hidden comment: R-805)
R12  value 2.2k  [R-805]  (hidden comment: R-805)
R13  value 2.2k  [R-805]  (hidden comment: R-805)
R15  value 4.87k  [R-805]  (hidden comment: R-805)
R16  value 2.2k  [R-805]  (hidden comment: R-805)
R17  value 2.2k  [R-805]  (hidden comment: R-805)
R18  value 1.5k  [R-805]  (hidden comment: R-805)
R21  value 2.2k  [R-805]  (hidden comment: R-805)
R22  value 2.2k  [R-805]  (hidden comment: R-805)
R24  value 2.2k  [R-805]  (hidden comment: R-805)
R25  value 1k  [R-805]  (hidden comment: R-805)
U1  DP83848  [DP83848]
U2  OSC  [OSC]

### Blocks framed on the sheet
Place this part near to DP83848: C1 C2 R1-R4

### Ports
CRS_DV (out), ETH_CLK (in), MDC (in), MDIO (in), RX_N (out), RX_P (out), TX_EN (in), TX_N (in), TX_P (in)

### Nets
+3.3V: C1.2 C2.2 C3.2 C4.2 C5.2 C7.1 C11.2 J1.4(TCT) J1.5(RCT) R1.1 R2.1 R3.2 R4.2 R5.1 R6.2 R8.1 R9.2 R10.2 R12.1 R13.2 R17.2 R18.1 R22.2 R25.1 U1.22(AVDD33) U1.32(IOVDD33) U1.48(IOVDD33) U2.1(EN) U2.4(VCC)
GND: C1.1 C2.1 C3.1 C4.1 C5.1 C6.1 C7.2 C8.1 C9.1 C10.1 C11.1 J1.8(GND) J1.13(SHIELD) J1.14(SHIELD) R7.2 R15.1 R16.1 R21.1 R24.1 U1.15(AGND) U1.19(AGND) U1.35(IOGND) U1.36(DGND) U1.47(IOGND) U2.2(GND)
AN0: J1.10 R17.1 R21.2 U1.28(LED_LINK)  [also labelled LED_LINK]
AN1: R22.1 R24.2 U1.27(LED_SPEED)
AN_EN: J1.11 R13.1 R16.2 U1.26(LED_ACT/COL)  [also labelled LED_ACT]
CLK_50MHz: U1.34(X1) U2.3(OUT) ; port ETH_CLK
ETH_RST: R25.2 U1.29(RESET_N)
PFB: C6.2 C8.2 C9.2 C10.2 U1.18(PFBIN1) U1.23(PFBOUT) U1.37(PFBIN2)
RD_N: J1.6(RD-) R2.2 U1.16(TD-)
RD_P: J1.3(RD+) R4.1 U1.17(TD+)
RMII_CRS_DV: U1.40(CRS/CRS_DV/LED_CFG) ; port CRS_DV
RMII_MDC: U1.31(MDC) ; port MDC
RMII_MDIO: R18.2 U1.30(MDIO) ; port MDIO
RMII_RX_N: U1.44(RXD1/PHYAD2) ; port RX_N
RMII_RX_P: U1.43(RXD0/PHYAD1) ; port RX_P
RMII_TX_EN: U1.2(TX_EN) ; port TX_EN
RMII_TX_N: U1.4(TXD_1) ; port TX_N
RMII_TX_P: U1.3(TXD_0) ; port TX_P
TD_N: J1.2(TD-) R1.2 U1.13(RD-)
TD_P: J1.1(TD+) R3.1 U1.14(RD+)
NetJ1_9: J1.9 R8.2
NetJ1_12: J1.12 R5.2
NetR6_1: R6.1 U1.7(POWER_DOWN/INT)
NetR7_1: R7.1 U1.6(TXD_3/SNI_MODE)
NetR9_1: R9.1 U1.20(RESERVED)
NetR10_1: R10.1 U1.21(RESERVED)
NetR12_2: R12.2 U1.39(RX_DV/MII_MODE)
NetR15_2: R15.2 U1.24(RBIAS)

Not connected (* = marked no-connect by the designer): J1 7(NC)*; U1 1(TX_CLK)* 5(TXD_2)* 8(TCK)* 9(TDO)* 10(TMS)* 11(~{TRST})* 12(TDI)* 25(25MHz) 33(X2)* 38(RX_CLK) 41(RX_ER/MDIX_EN) 42(COL/PHYAD0) 45(RXD2/PHYAD3) 46(RXD3/PHYAD4)

### Notes on the sheet
- -> avoid stubs
  -> differential traces run in parallel
  -> length tunning
  -> a entire trace on a single layer if possible
  -> TD+, TD-, RD+, RD- should have differential impedance 100 OHM
  -> Traces less than 6 inches
  Refer to : Doc\DP83848\1921661.pdf
  Refer to : Doc\DP83848\dp83848c-452813.pdf
  Refer to : Doc\DP83848\DP83848-Ethernet-Board-Schematic.pdf
  Refer to : Doc\DP83848\snla079d.pdf
- (near R13) common pad
- (near R17) common pad
- (near R22) common pad
- (in symbol DP83848) DS

### Library data of the parts
C1-C11 = C-805: Capacitor; Published: 8-Jun-2000; LatestRevisionDate: 29-May-2009; LatestRevisionNote: IPC-7351 Footprint Added.; PackageReference: C1206; Publisher: Altium Limited; PackageDescription: Chip Capacitor
J1 = RJ45+FILTER: RJ45 JACK
R1-R10 R12 R13 R15-R18 R21 R22 R24 R25 = R-805: Resistor
U1 = DP83848: ETHERNET PHY

## Sheet RSV.SchDoc
size A4
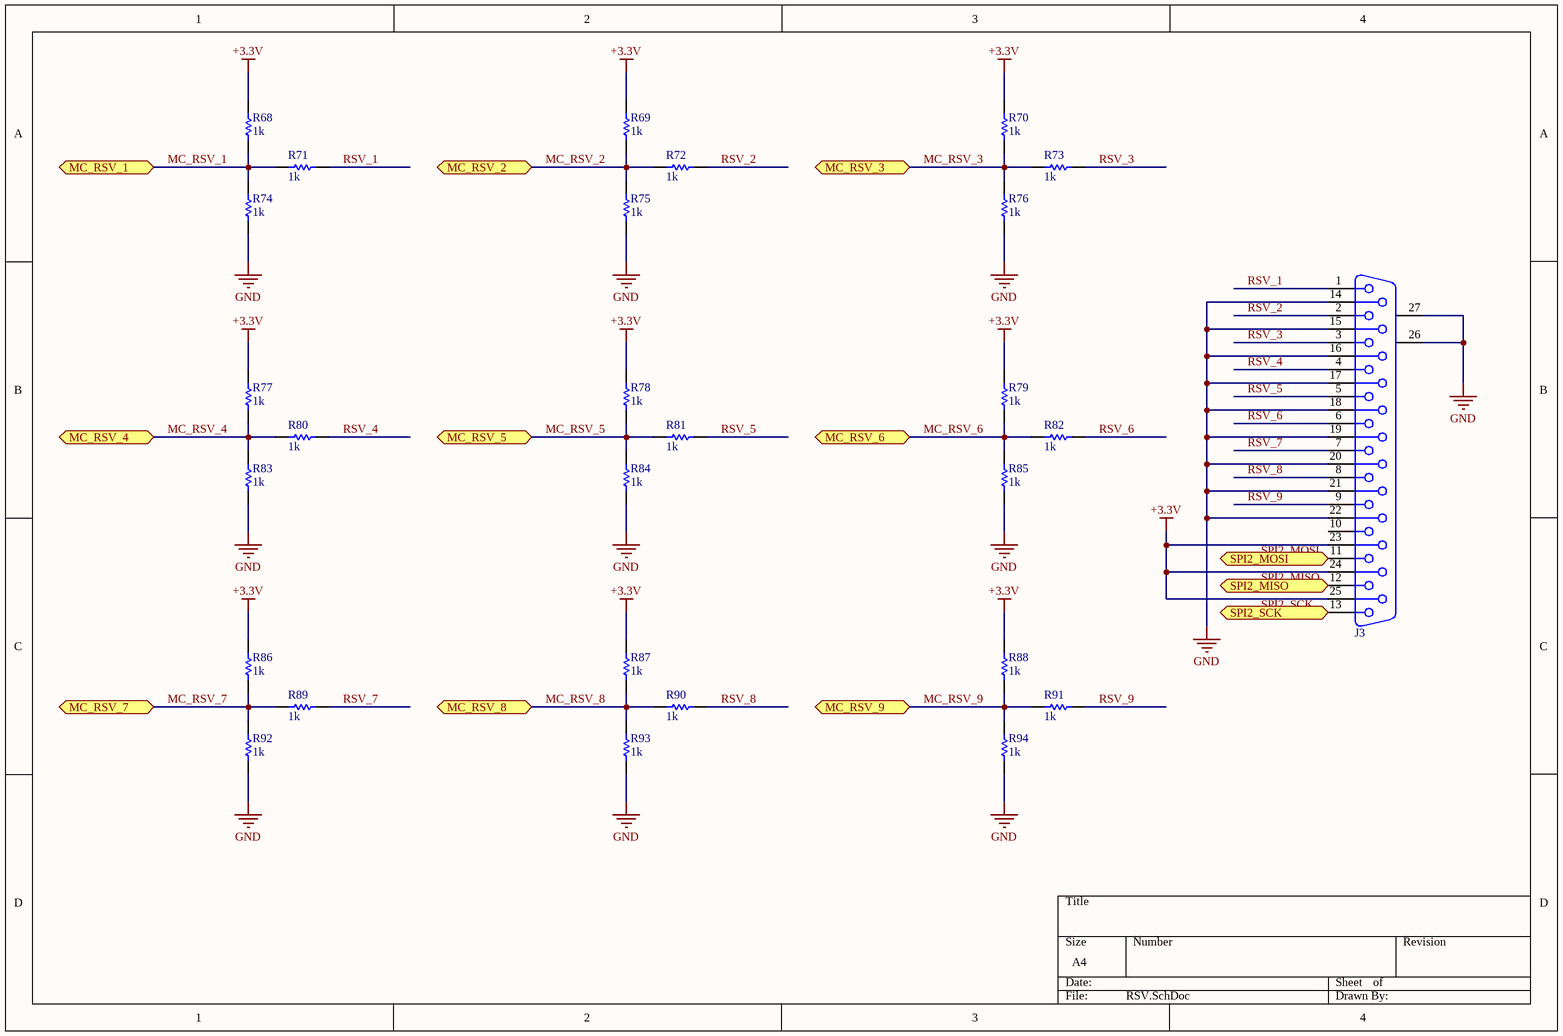
[diagram p6: RSV.SchDoc]

### Parts
J3  DB25_Straight  [DB25_Straight]  (value not drawn)
R68  value 1k  [R-805]  (hidden comment: R-805)
R69  value 1k  [R-805]  (hidden comment: R-805)
R70  value 1k  [R-805]  (hidden comment: R-805)
R71  value 1k  [R-805]  (hidden comment: R-805)
R72  value 1k  [R-805]  (hidden comment: R-805)
R73  value 1k  [R-805]  (hidden comment: R-805)
R74  value 1k  [R-805]  (hidden comment: R-805)
R75  value 1k  [R-805]  (hidden comment: R-805)
R76  value 1k  [R-805]  (hidden comment: R-805)
R77  value 1k  [R-805]  (hidden comment: R-805)
R78  value 1k  [R-805]  (hidden comment: R-805)
R79  value 1k  [R-805]  (hidden comment: R-805)
R80  value 1k  [R-805]  (hidden comment: R-805)
R81  value 1k  [R-805]  (hidden comment: R-805)
R82  value 1k  [R-805]  (hidden comment: R-805)
R83  value 1k  [R-805]  (hidden comment: R-805)
R84  value 1k  [R-805]  (hidden comment: R-805)
R85  value 1k  [R-805]  (hidden comment: R-805)
R86  value 1k  [R-805]  (hidden comment: R-805)
R87  value 1k  [R-805]  (hidden comment: R-805)
R88  value 1k  [R-805]  (hidden comment: R-805)
R89  value 1k  [R-805]  (hidden comment: R-805)
R90  value 1k  [R-805]  (hidden comment: R-805)
R91  value 1k  [R-805]  (hidden comment: R-805)
R92  value 1k  [R-805]  (hidden comment: R-805)
R93  value 1k  [R-805]  (hidden comment: R-805)
R94  value 1k  [R-805]  (hidden comment: R-805)

### Ports
MC_RSV_1, MC_RSV_2, MC_RSV_3, MC_RSV_4, MC_RSV_5, MC_RSV_6, MC_RSV_7, MC_RSV_8, MC_RSV_9, SPI2_MISO, SPI2_MOSI, SPI2_SCK

### Nets
+3.3V: J3.23 J3.24 J3.25 R68.2 R69.2 R70.2 R77.2 R78.2 R79.2 R86.2 R87.2 R88.2
GND: J3.14 J3.15 J3.16 J3.17 J3.18 J3.19 J3.20 J3.21 J3.22 J3.26(MH1) J3.27(MH2) R74.1 R75.1 R76.1 R83.1 R84.1 R85.1 R92.1 R93.1 R94.1
MC_RSV_1: R68.1 R71.2 R74.2 ; port MC_RSV_1
MC_RSV_2: R69.1 R72.2 R75.2 ; port MC_RSV_2
MC_RSV_3: R70.1 R73.2 R76.2 ; port MC_RSV_3
MC_RSV_4: R77.1 R80.2 R83.2 ; port MC_RSV_4
MC_RSV_5: R78.1 R81.2 R84.2 ; port MC_RSV_5
MC_RSV_6: R79.1 R82.2 R85.2 ; port MC_RSV_6
MC_RSV_7: R86.1 R89.2 R92.2 ; port MC_RSV_7
MC_RSV_8: R87.1 R90.2 R93.2 ; port MC_RSV_8
MC_RSV_9: R88.1 R91.2 R94.2 ; port MC_RSV_9
RSV_1: J3.1 R71.1
RSV_2: J3.2 R72.1
RSV_3: J3.3 R73.1
RSV_4: J3.4 R80.1
RSV_5: J3.5 R81.1
RSV_6: J3.6 R82.1
RSV_7: J3.7 R89.1
RSV_8: J3.8 R90.1
RSV_9: J3.9 R91.1
SPI2_MISO: J3.12 ; port SPI2_MISO
SPI2_MOSI: J3.11 ; port SPI2_MOSI
SPI2_SCK: J3.13 ; port SPI2_SCK

Not connected (* = marked no-connect by the designer): J3 10

### Notes on the sheet
- Labels drawn without touching a wire or pin: SPI2_MISO, SPI2_MOSI, SPI2_SCK

### Library data of the parts
J3 = DB25_Straight: Receptacle Assembly, 25 Position, Right Angle; PackageDocument: U; Positions: 25; Published: 15-Jun-2001; LatestRevisionDate: 17-Jul-2002; LatestRevisionNote: Re-released for DXP Platform.; DatasheetDocument: 19-Mar-1999; PackageReference: 787202; Publisher: Altium Limited; Orientation: Right Angle; Gender: Receptacle
R68-R94 = R-805: Resistor

## Sheet WindSpeed.SchDoc
size A4
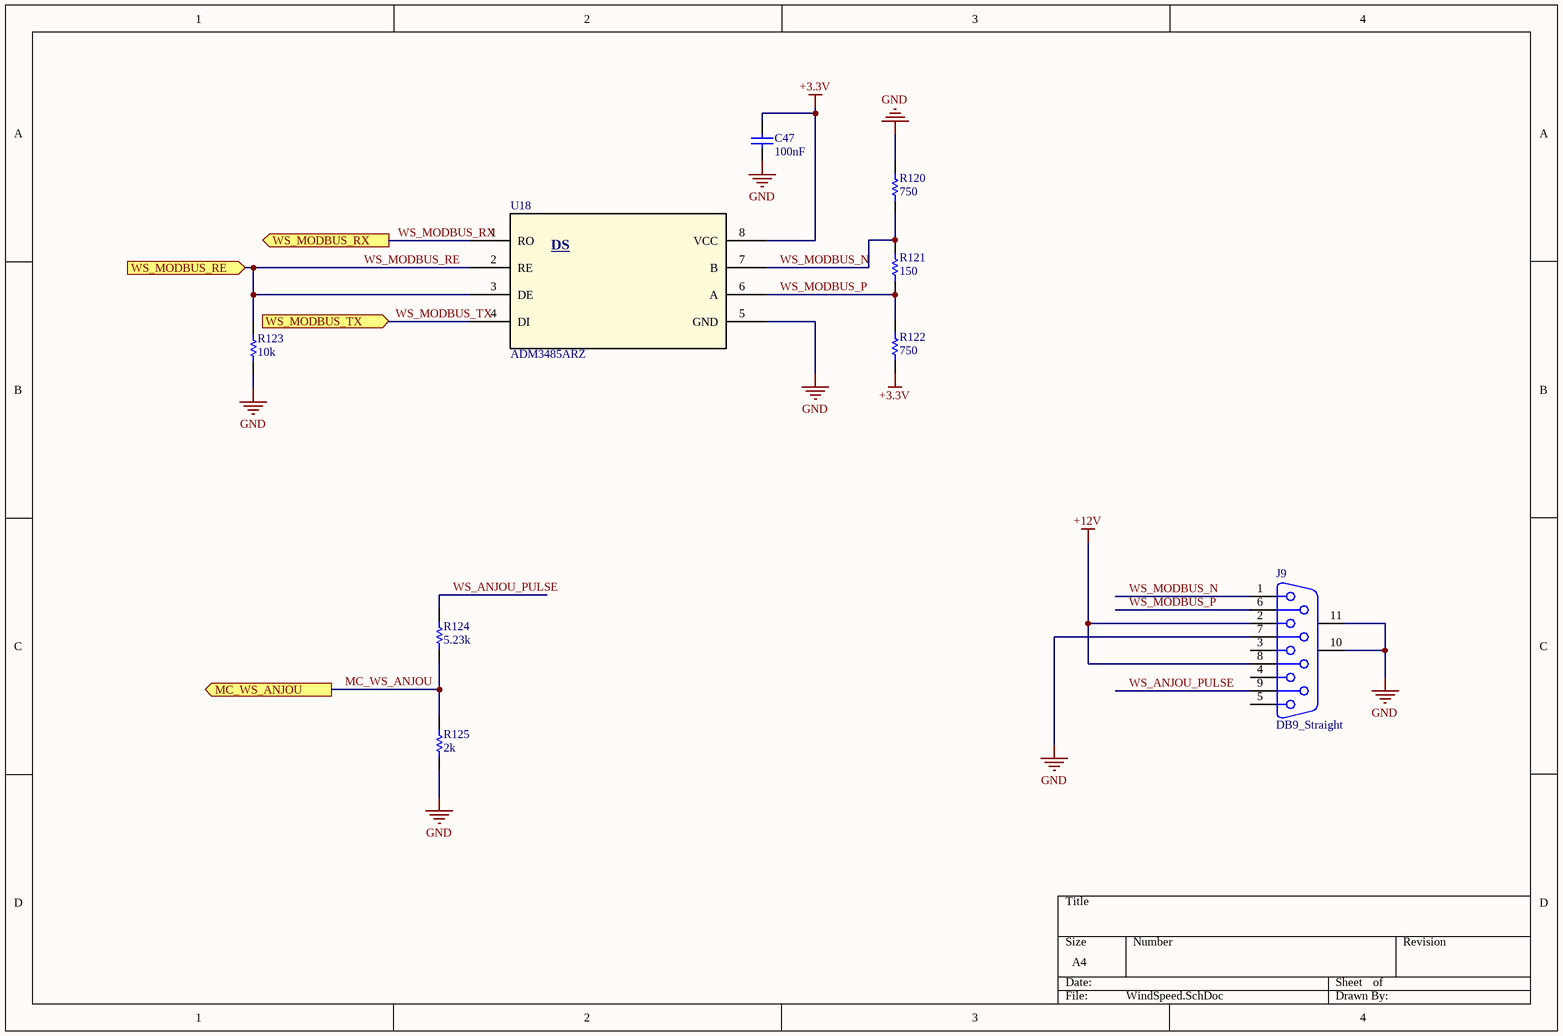
[diagram p7: WindSpeed.SchDoc]

### Parts
C47  value 100nF  [C-805]  (hidden comment: C-805)
J9  DB9_Straight  [DB9_Straight]
R120  value 750  [R-805]  (hidden comment: R-805)
R121  value 150  [R-805]  (hidden comment: R-805)
R122  value 750  [R-805]  (hidden comment: R-805)
R123  value 10k  [R-805]  (hidden comment: R-805)
R124  value 5.23k  [R-805]  (hidden comment: R-805)
R125  value 2k  [R-805]  (hidden comment: R-805)
U18  ADM3485ARZ  [R_8]

### Ports
MC_WS_ANJOU (out), WS_MODBUS_RE (in), WS_MODBUS_RX (out), WS_MODBUS_TX (in)

### Nets
+3.3V: C47.2 R122.1 U18.8(VCC)
+12V: J9.2 J9.8
GND: C47.1 J9.7 J9.10(MH1) J9.11(MH2) R120.2 R123.1 R125.1 U18.5(GND)
MC_WS_ANJOU: R124.1 R125.2 ; port MC_WS_ANJOU
WS_ANJOU_PULSE: J9.9 R124.2
WS_MODBUS_N: J9.1 R120.1 R121.2 U18.7(B)
WS_MODBUS_P: J9.6 R121.1 R122.2 U18.6(A)
WS_MODBUS_RE: R123.2 U18.2(RE) U18.3(DE) ; port WS_MODBUS_RE
WS_MODBUS_RX: U18.1(RO) ; port WS_MODBUS_RX  [project net UART6_RX]
WS_MODBUS_TX: U18.4(DI) ; port WS_MODBUS_TX  [project net UART6_TX]

Not connected (* = marked no-connect by the designer): J9 3 4 5

### Notes on the sheet
- (in symbol ADM3485ARZ) DS

### Library data of the parts
C47 = C-805: Capacitor; Published: 8-Jun-2000; LatestRevisionDate: 29-May-2009; LatestRevisionNote: IPC-7351 Footprint Added.; PackageReference: C1206; Publisher: Altium Limited; PackageDescription: Chip Capacitor
J9 = DB9_Straight: as J2 on sheet HMIInterface; Published: 15-Jun-2001; LatestRevisionDate: 17-Jul-2002; LatestRevisionNote: Re-released for DXP Platform.; DatasheetDocument: 1-Sep-1999; PackageReference: 788750; Publisher: Altium Limited; Orientation: Right Angle; Gender: Receptacle
R120-R125 = R-805: Resistor
U18 = ADM3485ARZ: as U4 on sheet HMIInterface; Manufacturer_Part_Number: ADM3485ARZ; Copyright: Copyright (C) 2018 Accelerated Designs. All rights reserved; RefDes: RefDes; Type: DEV; Value: Value

## Sheet WindDir.SchDoc
size A4
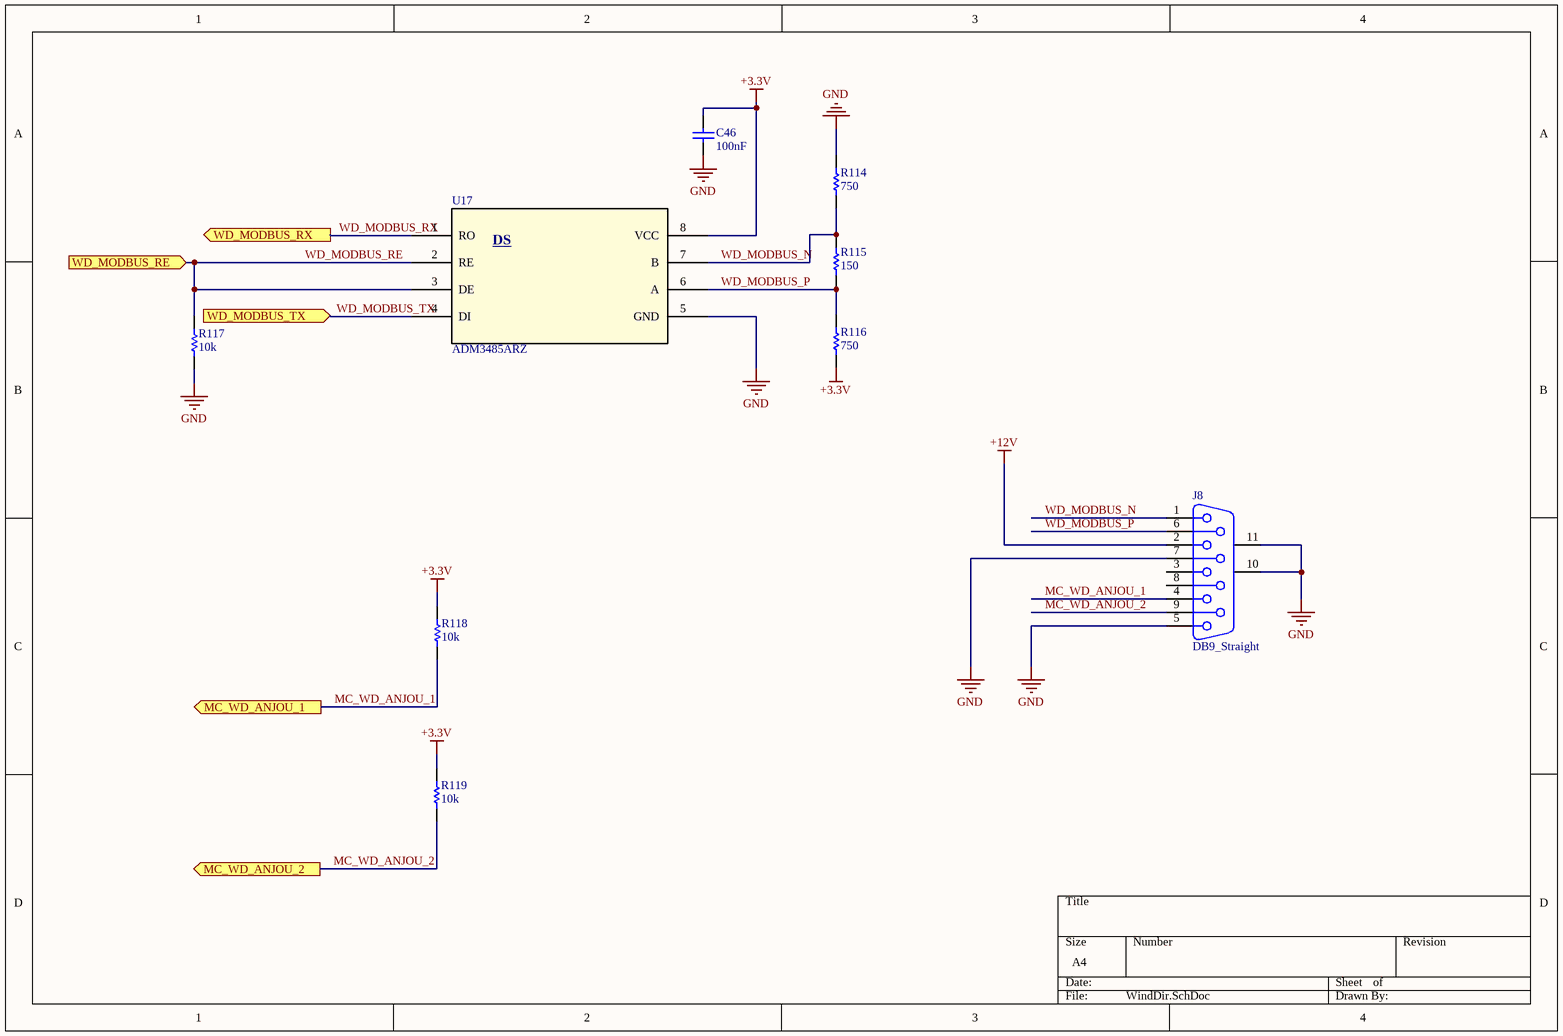
[diagram p8: WindDir.SchDoc]

### Parts
C46  value 100nF  [C-805]  (hidden comment: C-805)
J8  DB9_Straight  [DB9_Straight]
R114  value 750  [R-805]  (hidden comment: R-805)
R115  value 150  [R-805]  (hidden comment: R-805)
R116  value 750  [R-805]  (hidden comment: R-805)
R117  value 10k  [R-805]  (hidden comment: R-805)
R118  value 10k  [R-805]  (hidden comment: R-805)
R119  value 10k  [R-805]  (hidden comment: R-805)
U17  ADM3485ARZ  [R_8]

### Ports
MC_WD_ANJOU_1 (out), MC_WD_ANJOU_2 (out), WD_MODBUS_RE (in), WD_MODBUS_RX (out), WD_MODBUS_TX (in)

### Nets
+3.3V: C46.2 R116.1 R118.2 R119.2 U17.8(VCC)
+12V: J8.2
GND: C46.1 J8.5 J8.7 J8.10(MH1) J8.11(MH2) R114.2 R117.1 U17.5(GND)
MC_WD_ANJOU_1: J8.4 R118.1 ; port MC_WD_ANJOU_1
MC_WD_ANJOU_2: J8.9 R119.1 ; port MC_WD_ANJOU_2
WD_MODBUS_N: J8.1 R114.1 R115.2 U17.7(B)
WD_MODBUS_P: J8.6 R115.1 R116.2 U17.6(A)
WD_MODBUS_RE: R117.2 U17.2(RE) U17.3(DE) ; port WD_MODBUS_RE
WD_MODBUS_RX: U17.1(RO) ; port WD_MODBUS_RX  [project net UART3_RX]
WD_MODBUS_TX: U17.4(DI) ; port WD_MODBUS_TX  [project net UART3_TX]

Not connected (* = marked no-connect by the designer): J8 3 8

### Notes on the sheet
- (in symbol ADM3485ARZ) DS

### Library data of the parts
C46 = C-805: Capacitor; Published: 8-Jun-2000; LatestRevisionDate: 29-May-2009; LatestRevisionNote: IPC-7351 Footprint Added.; PackageReference: C1206; Publisher: Altium Limited; PackageDescription: Chip Capacitor
J8 = DB9_Straight: as J2 on sheet HMIInterface; Published: 15-Jun-2001; LatestRevisionDate: 17-Jul-2002; LatestRevisionNote: Re-released for DXP Platform.; DatasheetDocument: 1-Sep-1999; PackageReference: 788750; Publisher: Altium Limited; Orientation: Right Angle; Gender: Receptacle
R114-R119 = R-805: Resistor
U17 = ADM3485ARZ: as U4 on sheet HMIInterface; Manufacturer_Part_Number: ADM3485ARZ; Copyright: Copyright (C) 2018 Accelerated Designs. All rights reserved; RefDes: RefDes; Type: DEV; Value: Value

## Sheet Sensors.SchDoc
size A3
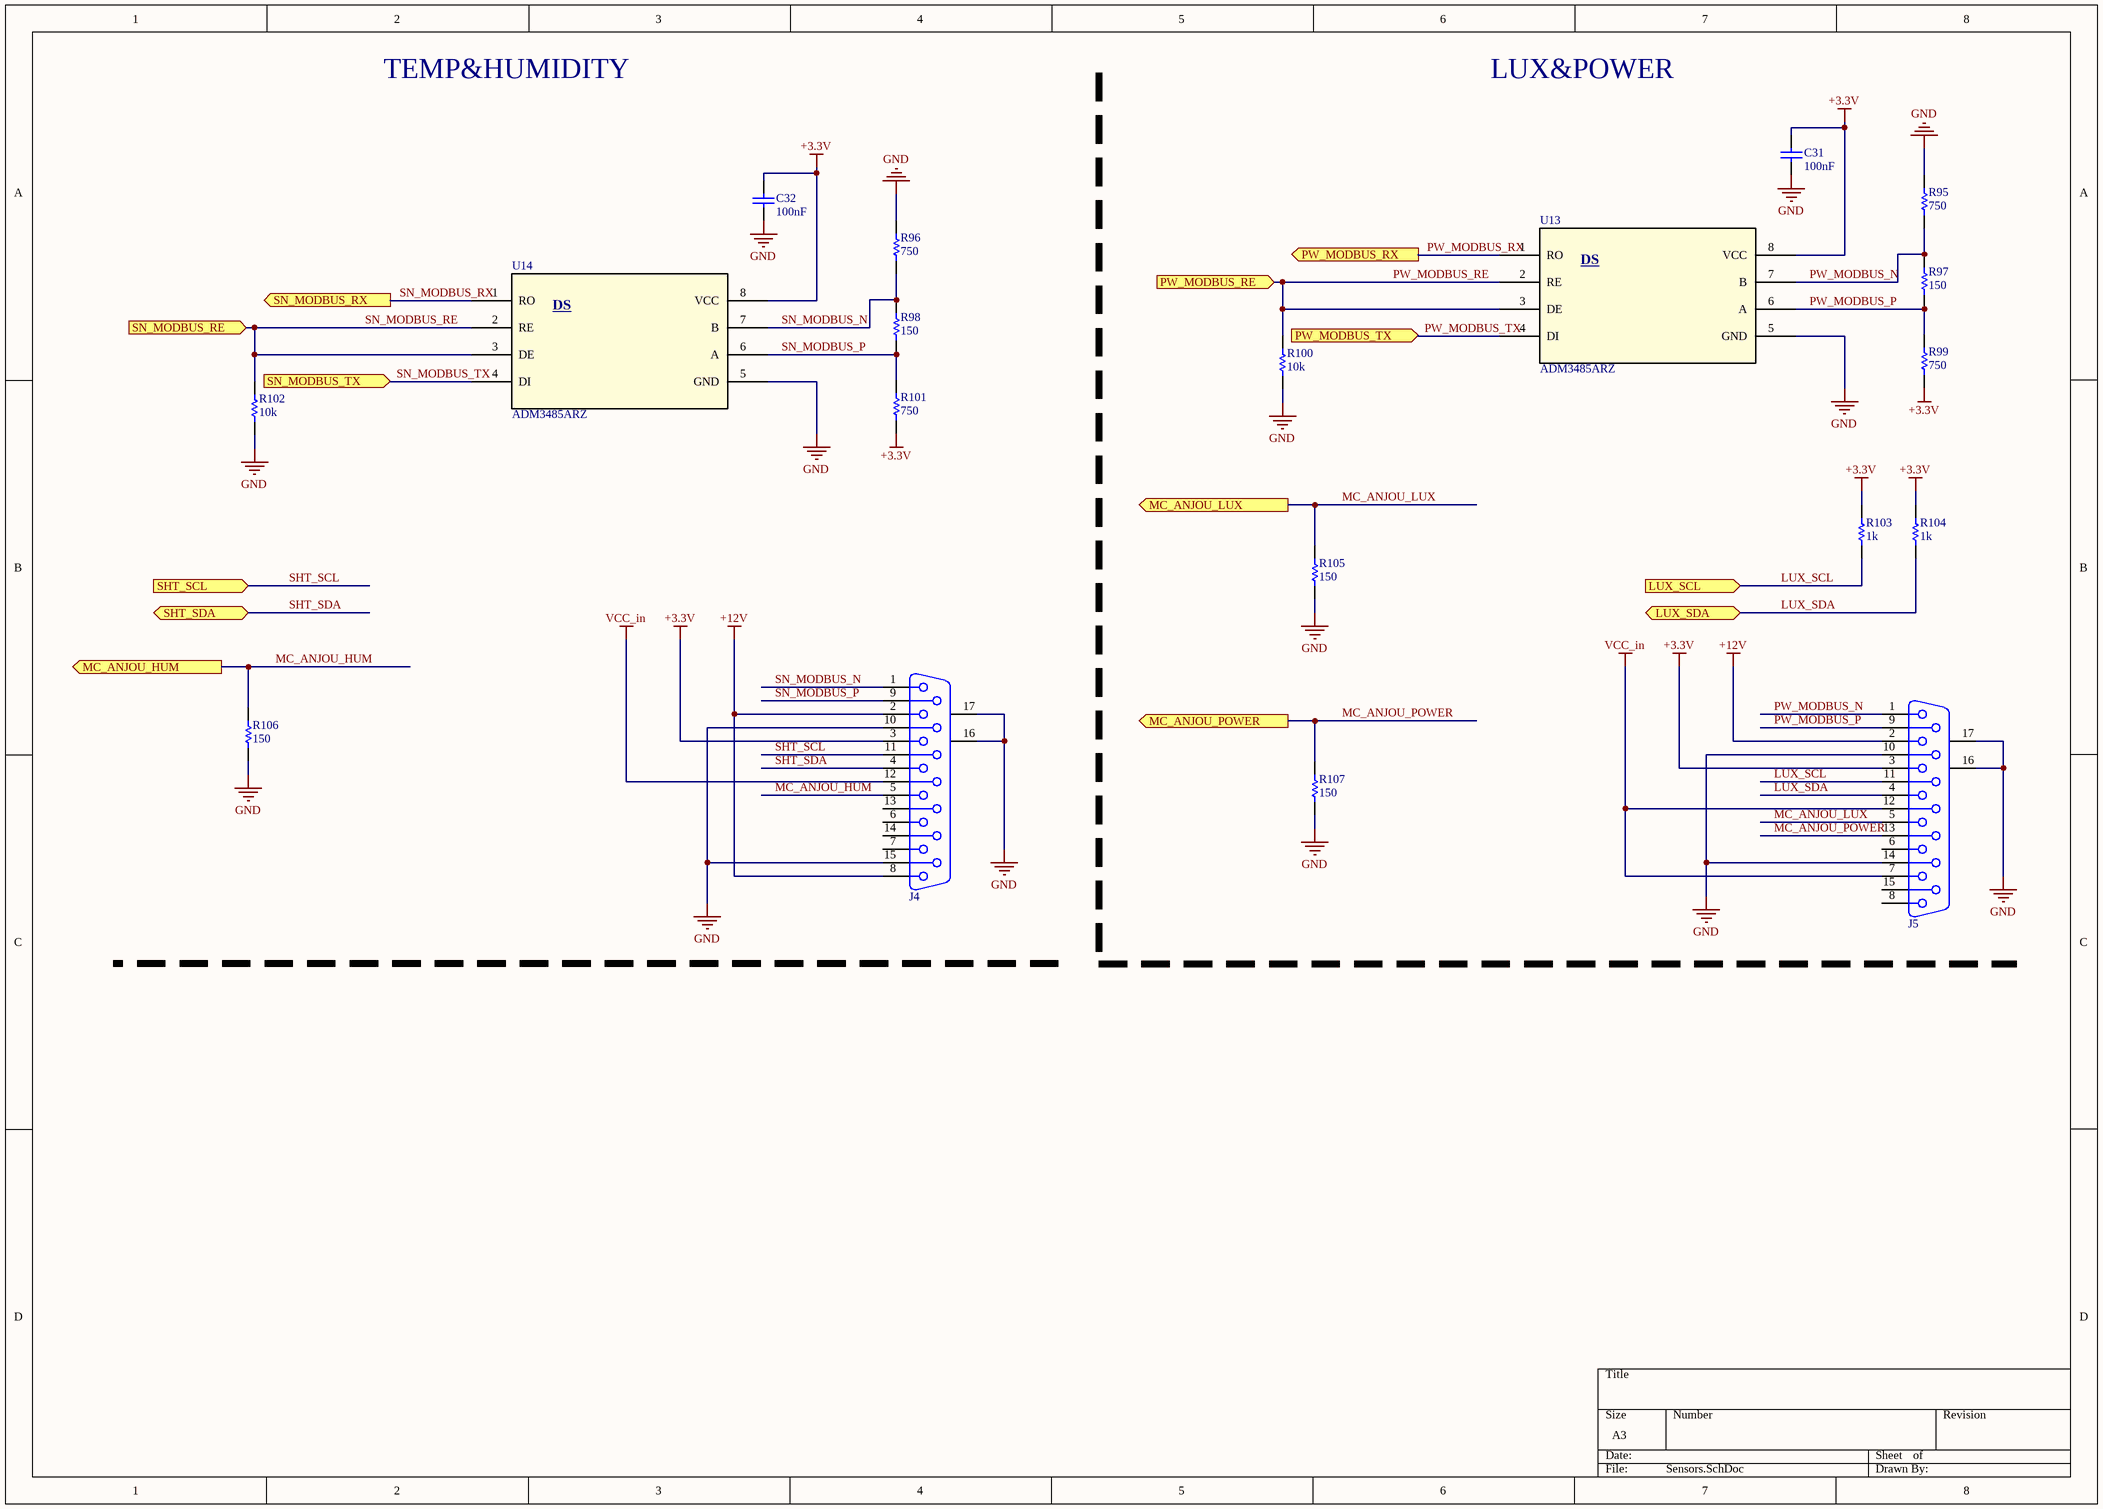
[diagram p9: Sensors.SchDoc]

### Parts
C31  value 100nF  [C-805]  (hidden comment: C-805)
C32  value 100nF  [C-805]  (hidden comment: C-805)
J4  DB15_Straight  [DB15_Straight]  (value not drawn)
J5  DB15_Straight  [DB15_Straight]  (value not drawn)
R95  value 750  [R-805]  (hidden comment: R-805)
R96  value 750  [R-805]  (hidden comment: R-805)
R97  value 150  [R-805]  (hidden comment: R-805)
R98  value 150  [R-805]  (hidden comment: R-805)
R99  value 750  [R-805]  (hidden comment: R-805)
R100  value 10k  [R-805]  (hidden comment: R-805)
R101  value 750  [R-805]  (hidden comment: R-805)
R102  value 10k  [R-805]  (hidden comment: R-805)
R103  value 1k  [R-805]  (hidden comment: R-805)
R104  value 1k  [R-805]  (hidden comment: R-805)
R105  value 150  [R-805]  (hidden comment: R-805)
R106  value 150  [R-805]  (hidden comment: R-805)
R107  value 150  [R-805]  (hidden comment: R-805)
U13  ADM3485ARZ  [R_8]
U14  ADM3485ARZ  [R_8]

### Ports
LUX_SCL (in), LUX_SDA (bidir), MC_ANJOU_HUM (out), MC_ANJOU_LUX (out), MC_ANJOU_POWER (out), PW_MODBUS_RE (in), PW_MODBUS_RX (out), PW_MODBUS_TX (in), SHT_SCL (in), SHT_SDA (bidir), SN_MODBUS_RE (in), SN_MODBUS_RX (out), SN_MODBUS_TX (in)

### Nets
+3.3V: C31.2 C32.2 J4.3 J5.3 R99.1 R101.1 R103.2 R104.2 U13.8(VCC) U14.8(VCC)
+12V: J4.2 J4.8 J5.2
GND: C31.1 C32.1 J4.10 J4.15 J4.16(MH1) J4.17(MH2) J5.10 J5.14 J5.16(MH1) J5.17(MH2) R95.2 R96.2 R100.1 R102.1 R105.1 R106.1 R107.1 U13.5(GND) U14.5(GND)
VCC_in: J4.12 J5.7 J5.12
LUX_SCL: J4.11 J5.11 R103.1 ; port SHT_SCL, port LUX_SCL  [also labelled SHT_SCL]
LUX_SDA: J4.4 J5.4 R104.1 ; port SHT_SDA, port LUX_SDA  [also labelled SHT_SDA]
MC_ANJOU_HUM: J4.5 R106.2 ; port MC_ANJOU_HUM  [project net AnalogIn_1]
MC_ANJOU_LUX: J5.5 R105.2 ; port MC_ANJOU_LUX  [project net AnalogIn_2]
MC_ANJOU_POWER: J5.13 R107.2 ; port MC_ANJOU_POWER  [project net AnalogIn_3]
PW_MODBUS_N: J5.1 R95.1 R97.2 U13.7(B)
PW_MODBUS_P: J5.9 R97.1 R99.2 U13.6(A)
PW_MODBUS_RE: R100.2 U13.2(RE) U13.3(DE) ; port PW_MODBUS_RE
PW_MODBUS_RX: U13.1(RO) ; port PW_MODBUS_RX
PW_MODBUS_TX: U13.4(DI) ; port PW_MODBUS_TX
SN_MODBUS_N: J4.1 R96.1 R98.2 U14.7(B)
SN_MODBUS_P: J4.9 R98.1 R101.2 U14.6(A)
SN_MODBUS_RE: R102.2 U14.2(RE) U14.3(DE) ; port SN_MODBUS_RE
SN_MODBUS_RX: U14.1(RO) ; port SN_MODBUS_RX
SN_MODBUS_TX: U14.4(DI) ; port SN_MODBUS_TX

Not connected (* = marked no-connect by the designer): J4 6 7 13 14; J5 6 8 15

### Notes on the sheet
- TEMP&HUMIDITY
- LUX&POWER
- (in symbol ADM3485ARZ) DS

### Library data of the parts
C31 C32 = C-805: Capacitor; Published: 8-Jun-2000; LatestRevisionDate: 29-May-2009; LatestRevisionNote: IPC-7351 Footprint Added.; PackageReference: C1206; Publisher: Altium Limited; PackageDescription: Chip Capacitor
J4 J5 = DB15_Straight: Receptacle Assembly, 15 Position, Right Angle; PackageDocument: O; Positions: 15; Published: 15-Jun-2001; LatestRevisionDate: 17-Jul-2002; LatestRevisionNote: Re-released for DXP Platform.; DatasheetDocument: 1-Sep-99; PackageReference: 788757; Publisher: Altium Limited; Orientation: Right Angle; Gender: Receptacle
R95-R107 = R-805: Resistor
U13 U14 = ADM3485ARZ: as U4 on sheet HMIInterface; Manufacturer_Part_Number: ADM3485ARZ; Copyright: Copyright (C) 2018 Accelerated Designs. All rights reserved; RefDes: RefDes; Type: DEV; Value: Value

## Sheet STM32F407VGT6.SchDoc
size A3
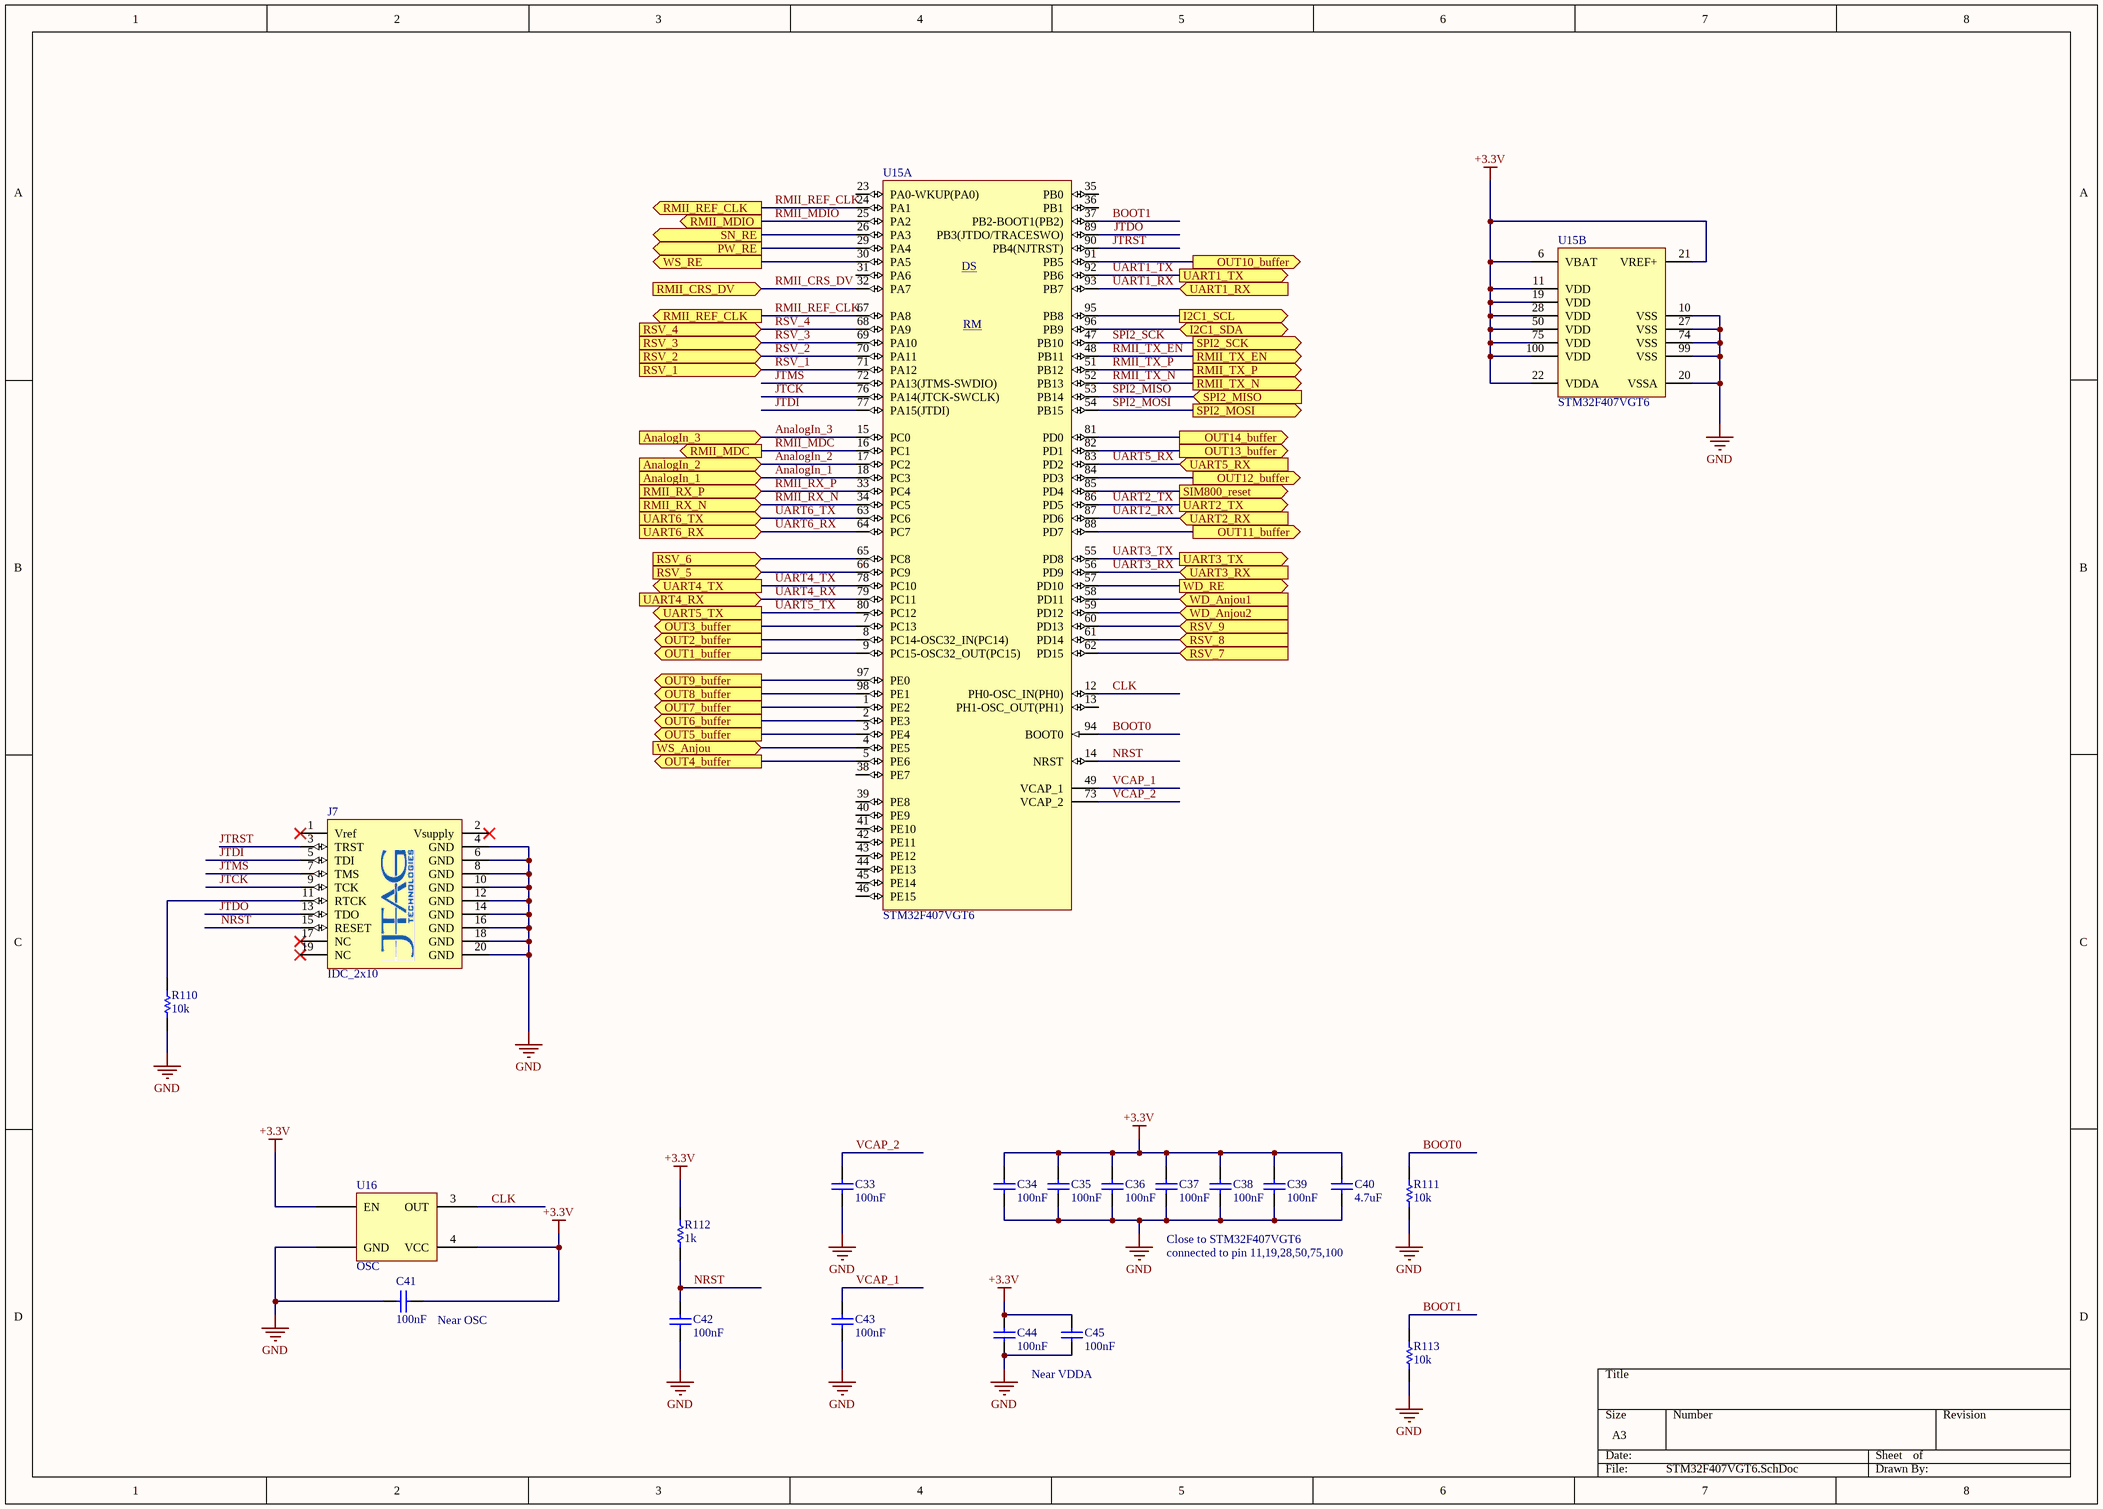
[diagram p10: STM32F407VGT6.SchDoc]

### Parts
C33  value 100nF  [C-805]  (hidden comment: C-805)
C34  value 100nF  [C-805]  (hidden comment: C-805)
C35  value 100nF  [C-805]  (hidden comment: C-805)
C36  value 100nF  [C-805]  (hidden comment: C-805)
C37  value 100nF  [C-805]  (hidden comment: C-805)
C38  value 100nF  [C-805]  (hidden comment: C-805)
C39  value 100nF  [C-805]  (hidden comment: C-805)
C40  value 4.7uF  [C-1206]  (hidden comment: C-1206)
C41  value 100nF  [C-805]  (hidden comment: C-805)
C42  value 100nF  [C-805]  (hidden comment: C-805)
C43  value 100nF  [C-805]  (hidden comment: C-805)
C44  value 100nF  [C-805]  (hidden comment: C-805)
C45  value 100nF  [C-805]  (hidden comment: C-805)
J7  IDC_2x10  [IDC2.54-V20D]
R110  value 10k  [R-805]  (hidden comment: R-805)
R111  value 10k  [R-805]  (hidden comment: R-805)
R112  value 1k  [R-805]  (hidden comment: R-805)
R113  value 10k  [R-805]  (hidden comment: R-805)
U15  STM32F407VGT6  [STM-LQFP100_N]  (parts A,B of 2)
U16  OSC  [OSC]

### Ports
AnalogIn_1 (in), AnalogIn_2 (in), AnalogIn_3 (in), I2C1_SCL (out), I2C1_SDA (bidir), OUT1_buffer (out), OUT2_buffer (out), OUT3_buffer (out), OUT4_buffer (out), OUT5_buffer (out), OUT6_buffer (out), OUT7_buffer (out), OUT8_buffer (out), OUT9_buffer (out), OUT10_buffer (out), OUT11_buffer (out), OUT12_buffer (out), OUT13_buffer (out), OUT14_buffer (out), PW_RE (out), RMII_CRS_DV (in), RMII_MDC (out), RMII_MDIO (out), RMII_REF_CLK (out), RMII_RX_N (in), RMII_RX_P (in), RMII_TX_EN (out), RMII_TX_N (out), RMII_TX_P (out), RSV_1 (in), RSV_2 (in), RSV_3 (in), RSV_4 (in), RSV_5 (in), RSV_6 (in), RSV_7 (in), RSV_8 (in), RSV_9 (in), SIM800_reset (out), SN_RE (out), SPI2_MISO (in), SPI2_MOSI (out), SPI2_SCK (out), UART1_RX (in), UART1_TX (out), UART2_RX (in), UART2_TX (out), UART3_RX (in), UART3_TX (out), UART4_RX (in), UART4_TX (out), UART5_RX (in), UART5_TX (out), UART6_RX (in), UART6_TX (in), WD_Anjou1 (in), WD_Anjou2 (in), WD_RE (out), WS_Anjou (in), WS_RE (out)

### Nets
+3.3V: C34.1 C35.1 C36.1 C37.1 C38.1 C39.1 C40.2 C41.1 C44.1 C45.1 R112.1 U15.6(VBAT) U15.11(VDD) U15.19(VDD) U15.21(VREF+) U15.22(VDDA) U15.28(VDD) U15.50(VDD) U15.75(VDD) U15.100(VDD) U16.1(EN) U16.4(VCC)
GND: C33.2 C34.2 C35.2 C36.2 C37.2 C38.2 C39.2 C40.1 C41.2 C42.2 C43.2 C44.2 C45.2 J7.4(GND) J7.6(GND) J7.8(GND) J7.10(GND) J7.12(GND) J7.14(GND) J7.16(GND) J7.18(GND) J7.20(GND) R110.1 R111.2 R113.2 U15.10(VSS) U15.20(VSSA) U15.27(VSS) U15.74(VSS) U15.99(VSS) U16.2(GND)
AnalogIn_1: U15.18(PC3) ; port AnalogIn_1
AnalogIn_2: U15.17(PC2) ; port AnalogIn_2
AnalogIn_3: U15.15(PC0) ; port AnalogIn_3
BOOT0: R111.1 U15.94(BOOT0)
BOOT1: R113.1 U15.37(PB2-BOOT1(PB2))
CLK: U15.12(PH0-OSC_IN(PH0)) U16.3(OUT)
JTCK: J7.9(TCK) U15.76(PA14(JTCK-SWCLK))
JTDI: J7.5(TDI) U15.77(PA15(JTDI))
JTDO: J7.13(TDO) U15.89(PB3(JTDO/TRACESWO))
JTMS: J7.7(TMS) U15.72(PA13(JTMS-SWDIO))
JTRST: J7.3(TRST) U15.90(PB4(NJTRST))
LUX_SCL: U15.95(PB8) ; port I2C1_SCL
LUX_SDA: U15.96(PB9) ; port I2C1_SDA
MC_RSV_5: U15.66(PC9) ; port RSV_5
MC_RSV_6: U15.65(PC8) ; port RSV_6
MC_RSV_7: U15.62(PD15) ; port RSV_7
MC_RSV_8: U15.61(PD14) ; port RSV_8
MC_RSV_9: U15.60(PD13) ; port RSV_9
MC_WD_ANJOU_1: U15.58(PD11) ; port WD_Anjou1
MC_WD_ANJOU_2: U15.59(PD12) ; port WD_Anjou2
MC_WS_ANJOU: U15.4(PE5) ; port WS_Anjou
NRST: C42.1 J7.15(RESET) R112.2 U15.14(NRST)
OUT1_buffer: U15.9(PC15-OSC32_OUT(PC15)) ; port OUT1_buffer
OUT2_buffer: U15.8(PC14-OSC32_IN(PC14)) ; port OUT2_buffer
OUT3_buffer: U15.7(PC13) ; port OUT3_buffer
OUT4_buffer: U15.5(PE6) ; port OUT4_buffer
OUT5_buffer: U15.3(PE4) ; port OUT5_buffer
OUT6_buffer: U15.2(PE3) ; port OUT6_buffer
OUT7_buffer: U15.1(PE2) ; port OUT7_buffer
OUT8_buffer: U15.98(PE1) ; port OUT8_buffer
OUT9_buffer: U15.97(PE0) ; port OUT9_buffer
OUT10_buffer: U15.91(PB5) ; port OUT10_buffer
OUT11_buffer: U15.88(PD7) ; port OUT11_buffer
OUT12_buffer: U15.84(PD3) ; port OUT12_buffer
OUT13_buffer: U15.82(PD1) ; port OUT13_buffer
OUT14_buffer: U15.81(PD0) ; port OUT14_buffer
PW_MODBUS_RE: U15.29(PA4) ; port PW_RE
RMII_CRS_DV: U15.32(PA7) ; port RMII_CRS_DV
RMII_MDC: U15.16(PC1) ; port RMII_MDC
RMII_MDIO: U15.25(PA2) ; port RMII_MDIO
RMII_REF_CLK: U15.24(PA1) U15.67(PA8) ; port RMII_REF_CLK  [project net CLK_50MHz]
RMII_RX_N: U15.34(PC5) ; port RMII_RX_N
RMII_RX_P: U15.33(PC4) ; port RMII_RX_P
RMII_TX_EN: U15.48(PB11) ; port RMII_TX_EN
RMII_TX_N: U15.52(PB13) ; port RMII_TX_N
RMII_TX_P: U15.51(PB12) ; port RMII_TX_P
RSV_1: U15.71(PA12) ; port RSV_1  [project net MC_RSV_1]
RSV_2: U15.70(PA11) ; port RSV_2  [project net MC_RSV_2]
RSV_3: U15.69(PA10) ; port RSV_3  [project net MC_RSV_3]
RSV_4: U15.68(PA9) ; port RSV_4  [project net MC_RSV_4]
SN_MODBUS_RE: U15.26(PA3) ; port SN_RE
SPI2_MISO: U15.53(PB14) ; port SPI2_MISO
SPI2_MOSI: U15.54(PB15) ; port SPI2_MOSI
SPI2_SCK: U15.47(PB10) ; port SPI2_SCK
UART1_RX: U15.93(PB7) ; port UART1_RX  [project net PW_MODBUS_RX]
UART1_TX: U15.92(PB6) ; port UART1_TX  [project net PW_MODBUS_TX]
UART2_RX: U15.87(PD6) ; port UART2_RX  [project net SN_MODBUS_RX]
UART2_TX: U15.86(PD5) ; port UART2_TX  [project net SN_MODBUS_TX]
UART3_RX: U15.56(PD9) ; port UART3_RX
UART3_TX: U15.55(PD8) ; port UART3_TX
UART4_RX: U15.79(PC11) ; port UART4_RX  [project net MC_HMI_RX]
UART4_TX: U15.78(PC10) ; port UART4_TX  [project net MC_HMI_TX]
UART5_RX: U15.83(PD2) ; port UART5_RX  [project net Sim800_TX]
UART5_TX: U15.80(PC12) ; port UART5_TX  [project net Sim800_RX]
UART6_RX: U15.64(PC7) ; port UART6_RX
UART6_TX: U15.63(PC6) ; port UART6_TX
VCAP_1: C43.1 U15.49(VCAP_1)
VCAP_2: C33.1 U15.73(VCAP_2)
WD_MODBUS_RE: U15.57(PD10) ; port WD_RE
WS_MODBUS_RE: U15.30(PA5) ; port WS_RE
NetJ7_11: J7.11(RTCK) R110.2
NetM1_4: U15.85(PD4) ; port SIM800_reset

Not connected (* = marked no-connect by the designer): J7 1(Vref)* 2(Vsupply)* 17(NC)* 19(NC)*; U15 13(PH1-OSC_OUT(PH1)) 23(PA0-WKUP(PA0)) 31(PA6) 35(PB0) 36(PB1) 38(PE7) 39(PE8) 40(PE9) 41(PE10) 42(PE11) 43(PE12) 44(PE13) 45(PE14) 46(PE15)

### Notes on the sheet
- Close to STM32F407VGT6
- connected to pin 11,19,28,50,75,100
- (near C41) Near OSC
- Near VDDA
- (in symbol STM32F407VGT6, part A) DS; RM

### Library data of the parts
C33-C39 C41-C45 = C-805: Capacitor; Published: 8-Jun-2000; LatestRevisionDate: 29-May-2009; LatestRevisionNote: IPC-7351 Footprint Added.; PackageReference: C1206; Publisher: Altium Limited; PackageDescription: Chip Capacitor
C40 = C-1206: Capacitor; Published: 8-Jun-2000; LatestRevisionDate: 29-May-2009; LatestRevisionNote: IPC-7351 Footprint Added.; PackageReference: C1206; Publisher: Altium Limited; PackageDescription: Chip Capacitor
J7 = JTAG_JLINK: 20 Pin Standard JTAG Header For ARM JLINK; Company: SJ Libraries; Connector type: IDC2.54-20; designer: Eng. Saeid Jorablo; Max Current: mA; Positions: 20; Revision 1: 7/8/2012: Create Model; Category: Headers; ComponentLink1Description: Datasheet; ComponentLink2Description: Reference; Mounting Technology: Through-Hole; Orientation: Vertical; Pin Count: 20; Publisher: SJ UnLimited; Status: Unreleased; Update: 7/8/2012; HelpURL: http://s3.picofile.com/file/7443264187/Coming_Soon_logo.gif
R110-R113 = R-805: Resistor
U15 = STM32F407VGT6: ARM Cortex-M4 32-bit MCU+FPU, 210 DMIPS, 1024 kB Flash, 192 kB Internal RAM, 82 I/Os, 100-pin LQFP, -40 to 85 degC, Tray; Manufacturer: STMicroelectronics; D/A Converter: 2x12-bit; FLASH Size (Prog) (kB): 1024; I/Os (High Current): 82; Internal RAM Size (kB): 192; Operating Frequency(F) (Processor speed) (MHz): 168; Supply Voltage(Vcc) max (V): 3.6; Supply Voltage(Vcc) min (V): 1.8; DatasheetVersion: Rev. 4; PackageVersion: Rev. 1, 06/2013; PackageReference: LQFP100; PackageDescription: 100-Pin Low Profile Quad Flat Package, 14 x 14 mm Body, 0.5 mm Pitch; Supplier 1: Digi-Key; Supplier Part Number 1: 497-11605-ND; Supplier 2: Farnell; Supplier Part Number 2: 2064368; Supplier 3: Newark; Supplier Part Number 3: 73T2333; Supplier 4: Mouser; Supplier Part Number 4: 511-STM32F407VGT6; Core: ARM Cortex-M4; Packing: Tray; Mounting Technology: Surface Mount; PartNumber: STM32F407VGT6; ComponentLink1Description: Manufacturer URL; ComponentLink1URL: http://www.st.com/web/en/home.html; ComponentLink2Description: Datasheet; ComponentLink2URL: http://www.st.com/st-web-ui/static/active/en/resource/technical/document/datasheet/DM00037051.pdf; ComponentLink3Description: Package Specification; ComponentLink3URL: http://www.st.com/st-web-ui/static/active/en/resource/technical/document/data_brief/DM00071938.pdf

## Nets that join several sheets
+3.3V: Power (R50.2 R61.2), HMIInterface (9 pins), ETH (29 pins), RSV (12 pins), WindSpeed (C47.2 R122.1 U18.8), WindDir (5 pins), Sensors (10 pins), STM32F407VGT6 (22 pins)
+4V: Power (R54.2 R62.2), SIM800 (M1.5)
+5V: Power (R57.2 R63.2), Outputs (16 pins)
+12V: Power (R52.2 R60.2 R64.2 R108.2), WindSpeed (J9.2 J9.8), WindDir (J8.2), Sensors (J4.2 J4.8 J5.2)
GND: Main (8 pins), Power (35 pins), SIM800 (M1.1), Outputs (16 pins), HMIInterface (14 pins), ETH (25 pins), RSV (20 pins), WindSpeed (8 pins), WindDir (8 pins), Sensors (19 pins), STM32F407VGT6 (31 pins)
VCC_in: Power (13 pins), Sensors (J4.12 J5.7 J5.12)
AnalogIn_1: Sensors (J4.5 R106.2), STM32F407VGT6 (U15.18)
AnalogIn_2: Sensors (J5.5 R105.2), STM32F407VGT6 (U15.17)
AnalogIn_3: Sensors (J5.13 R107.2), STM32F407VGT6 (U15.15)
CLK_50MHz: ETH (U1.34 U2.3), STM32F407VGT6 (U15.24 U15.67)
LUX_SCL: Sensors (J4.11 J5.11 R103.1), STM32F407VGT6 (U15.95)
LUX_SDA: Sensors (J4.4 J5.4 R104.1), STM32F407VGT6 (U15.96)
MC_HMI_RX: HMIInterface (U3.9 U4.1), STM32F407VGT6 (U15.79)
MC_HMI_TX: HMIInterface (U3.10 U5.4), STM32F407VGT6 (U15.78)
MC_RSV_1: RSV (R68.1 R71.2 R74.2), STM32F407VGT6 (U15.71)
MC_RSV_2: RSV (R69.1 R72.2 R75.2), STM32F407VGT6 (U15.70)
MC_RSV_3: RSV (R70.1 R73.2 R76.2), STM32F407VGT6 (U15.69)
MC_RSV_4: RSV (R77.1 R80.2 R83.2), STM32F407VGT6 (U15.68)
MC_RSV_5: RSV (R78.1 R81.2 R84.2), STM32F407VGT6 (U15.66)
MC_RSV_6: RSV (R79.1 R82.2 R85.2), STM32F407VGT6 (U15.65)
MC_RSV_7: RSV (R86.1 R89.2 R92.2), STM32F407VGT6 (U15.62)
MC_RSV_8: RSV (R87.1 R90.2 R93.2), STM32F407VGT6 (U15.61)
MC_RSV_9: RSV (R88.1 R91.2 R94.2), STM32F407VGT6 (U15.60)
MC_WD_ANJOU_1: WindDir (J8.4 R118.1), STM32F407VGT6 (U15.58)
MC_WD_ANJOU_2: WindDir (J8.9 R119.1), STM32F407VGT6 (U15.59)
MC_WS_ANJOU: WindSpeed (R124.1 R125.2), STM32F407VGT6 (U15.4)
NetM1_4: SIM800 (M1.4), STM32F407VGT6 (U15.85)
OUT1_buffer: Outputs (R30.2 U6.1), STM32F407VGT6 (U15.9)
OUT2_buffer: Outputs (R31.2 U6.2), STM32F407VGT6 (U15.8)
OUT3_buffer: Outputs (R32.2 U6.3), STM32F407VGT6 (U15.7)
OUT4_buffer: Outputs (R33.2 U6.4), STM32F407VGT6 (U15.5)
OUT5_buffer: Outputs (R34.2 U6.5), STM32F407VGT6 (U15.3)
OUT6_buffer: Outputs (R35.2 U6.6), STM32F407VGT6 (U15.2)
OUT7_buffer: Outputs (R36.2 U6.7), STM32F407VGT6 (U15.1)
OUT8_buffer: Outputs (R37.2 U7.1), STM32F407VGT6 (U15.98)
OUT9_buffer: Outputs (R38.2 U7.2), STM32F407VGT6 (U15.97)
OUT10_buffer: Outputs (R39.2 U7.3), STM32F407VGT6 (U15.91)
OUT11_buffer: Outputs (R40.2 U7.4), STM32F407VGT6 (U15.88)
OUT12_buffer: Outputs (R41.2 U7.5), STM32F407VGT6 (U15.84)
OUT13_buffer: Outputs (R42.2 U7.6), STM32F407VGT6 (U15.82)
OUT14_buffer: Outputs (R43.2 U7.7), STM32F407VGT6 (U15.81)
PW_MODBUS_RE: Sensors (R100.2 U13.2 U13.3), STM32F407VGT6 (U15.29)
PW_MODBUS_RX: Sensors (U13.1), STM32F407VGT6 (U15.93)
PW_MODBUS_TX: Sensors (U13.4), STM32F407VGT6 (U15.92)
RMII_CRS_DV: ETH (U1.40), STM32F407VGT6 (U15.32)
RMII_MDC: ETH (U1.31), STM32F407VGT6 (U15.16)
RMII_MDIO: ETH (R18.2 U1.30), STM32F407VGT6 (U15.25)
RMII_RX_N: ETH (U1.44), STM32F407VGT6 (U15.34)
RMII_RX_P: ETH (U1.43), STM32F407VGT6 (U15.33)
RMII_TX_EN: ETH (U1.2), STM32F407VGT6 (U15.48)
RMII_TX_N: ETH (U1.4), STM32F407VGT6 (U15.52)
RMII_TX_P: ETH (U1.3), STM32F407VGT6 (U15.51)
Sim800_RX: SIM800 (R126.2), STM32F407VGT6 (U15.80)
Sim800_TX: SIM800 (R109.2), STM32F407VGT6 (U15.83)
SN_MODBUS_RE: Sensors (R102.2 U14.2 U14.3), STM32F407VGT6 (U15.26)
SN_MODBUS_RX: Sensors (U14.1), STM32F407VGT6 (U15.87)
SN_MODBUS_TX: Sensors (U14.4), STM32F407VGT6 (U15.86)
SPI2_MISO: RSV (J3.12), STM32F407VGT6 (U15.53)
SPI2_MOSI: RSV (J3.11), STM32F407VGT6 (U15.54)
SPI2_SCK: RSV (J3.13), STM32F407VGT6 (U15.47)
UART3_RX: WindDir (U17.1), STM32F407VGT6 (U15.56)
UART3_TX: WindDir (U17.4), STM32F407VGT6 (U15.55)
UART6_RX: WindSpeed (U18.1), STM32F407VGT6 (U15.64)
UART6_TX: WindSpeed (U18.4), STM32F407VGT6 (U15.63)
WD_MODBUS_RE: WindDir (R117.2 U17.2 U17.3), STM32F407VGT6 (U15.57)
WS_MODBUS_RE: WindSpeed (R123.2 U18.2 U18.3), STM32F407VGT6 (U15.30)